# Altium project T35_V2.PrjPCB
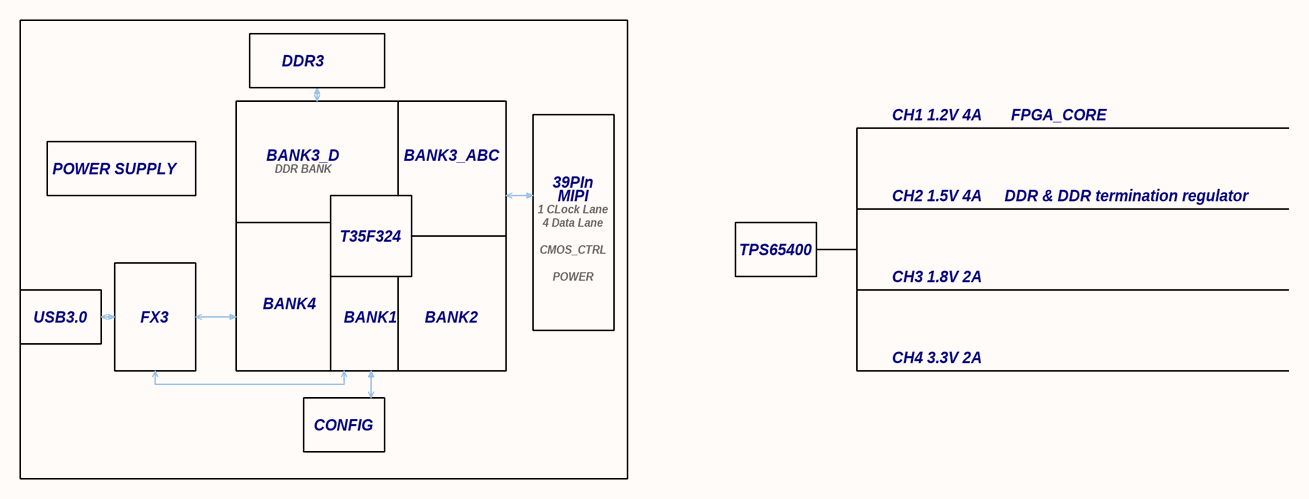
[diagram p0: T35_0_BlockSch&POWERTREE.SchDoc]
9 sheets, 356 parts. Net scope: global (net labels, ports and power ports of the same name join across sheets).
Board file: T35_V2.1.PcbDoc
Sheets:
  T35_0_BlockSch&POWERTREE.SchDoc
  T35_1_IO.SchDoc
  T35_2_POWER_CONFIG.SchDoc
  T35_3_POWERSUPPLY.SchDoc
  T35_4_FX3.SchDoc
  T35_5_MIPI.SchDoc
  T35_6_DDR3.SchDoc
  T35_7_MEMORY.SchDoc
  T35_8_CONNECTORS.SchDoc

## Sheet T35_0_BlockSch&POWERTREE.SchDoc
size A4

### Notes on the sheet
- DDR3
- CH1 1.2V 4A
- FPGA_CORE
- POWER SUPPLY
- BANK3_D
- DDR BANK
- BANK3_ABC
- MIPI
- 39PIn
- CH2 1.5V 4A
- DDR & DDR termination regulator
- T35F324
- 1 CLock Lane
- 4 Data Lane
- CMOS_CTRL
- TPS65400
- USB3.0
- FX3
- BANK4
- BANK1
- BANK2
- POWER
- CH3 1.8V 2A
- CH4 3.3V 2A
- CONFIG

## Sheet T35_1_IO.SchDoc
size A4
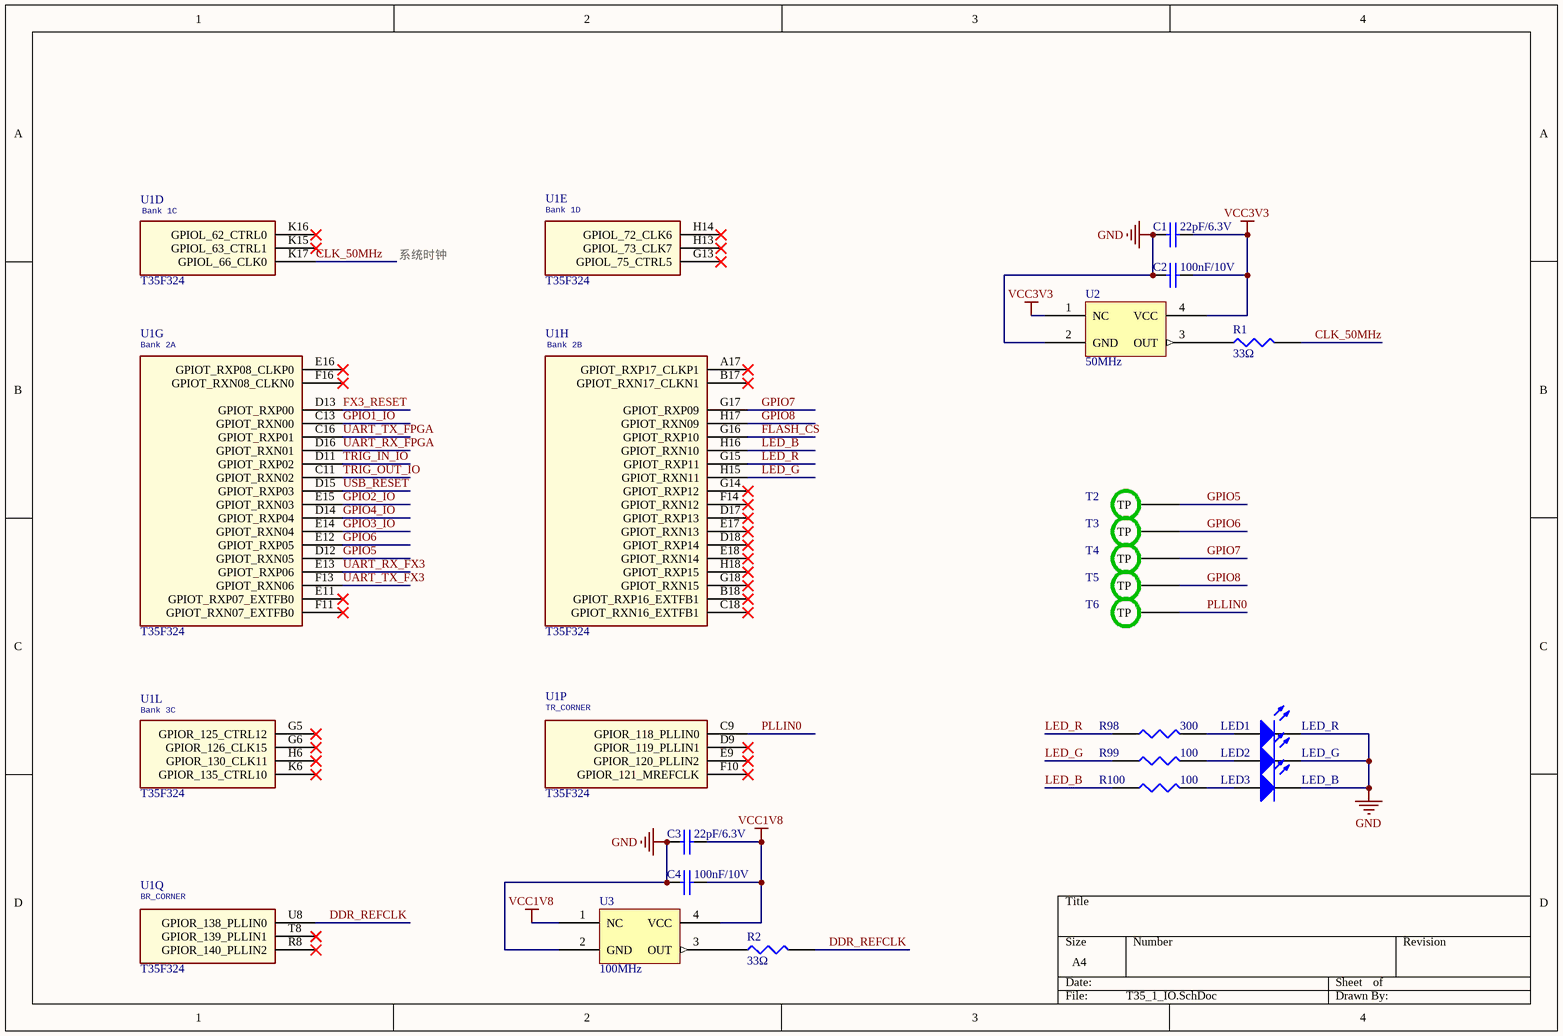
[diagram p1: T35_1_IO.SchDoc]

### Parts
C1  22pF/6.3V  [0201CS]
C2  100nF/10V  [0201CS]
C3  22pF/6.3V  [0201CS]
C4  100nF/10V  [0201CS]
LED1  LED_R  [0402LED]
LED2  LED_G  [0402LED]
LED3  LED_B  [0402LED]
R1  33Ω  [0402RS]
R2  33Ω  [0402RS]
R98  300  [0201RS]
R99  100  [0201RS]
R100  100  [0201RS]
T2  (no value)  [TP-S]
T3  (no value)  [TP-S]
T4  (no value)  [TP-S]
T5  (no value)  [TP-S]
T6  (no value)  [TP-S]
U1  T35F324  [T35-F324-BGA100P9X9-81A]  (parts D,E,G,H,L,P,Q of 17)
U2  50MHz  [XTAL_SMD_SMALL]
U3  100MHz  [XTAL_SMD_SMALL]

### Nets
GND: C1.1 C2.2 C3.1 C4.2 LED1.2(K) LED2.2(K) LED3.2(K) U2.2(GND) U3.2(GND)
VCC1V8: C3.2 C4.1 U3.1(NC) U3.4(VCC)
VCC3V3: C1.2 C2.1 U2.1(NC) U2.4(VCC)
CLK_50MHz: R1.2 U1.K17(GPIOL_66_CLK0)
DDR_REFCLK: R2.2 U1.U8(GPIOR_138_PLLIN0)
FLASH_CS: U1.G16(GPIOT_RXP10)
FX3_RESET: U1.D13(GPIOT_RXP00)
GPIO1_IO: U1.C13(GPIOT_RXN00)
GPIO2_IO: U1.E15(GPIOT_RXN03)
GPIO3_IO: U1.E14(GPIOT_RXN04)
GPIO4_IO: U1.D14(GPIOT_RXP04)
GPIO5: T2.1(TP) U1.D12(GPIOT_RXN05)
GPIO6: T3.1(TP) U1.E12(GPIOT_RXP05)
GPIO7: T4.1(TP) U1.G17(GPIOT_RXP09)
GPIO8: T5.1(TP) U1.H17(GPIOT_RXN09)
LED_B: R100.1 U1.H16(GPIOT_RXN10)
LED_G: R99.1 U1.H15(GPIOT_RXN11)
LED_R: R98.1 U1.G15(GPIOT_RXP11)
PLLIN0: T6.1(TP) U1.C9(GPIOR_118_PLLIN0)
TRIG_IN_IO: U1.D11(GPIOT_RXP02)
TRIG_OUT_IO: U1.C11(GPIOT_RXN02)
UART_RX_FPGA: U1.D16(GPIOT_RXN01)
UART_RX_FX3: U1.E13(GPIOT_RXP06)
UART_TX_FPGA: U1.C16(GPIOT_RXP01)
UART_TX_FX3: U1.F13(GPIOT_RXN06)
USB_RESET: U1.D15(GPIOT_RXP03)
NetLED1_1: LED1.1(A) R98.2
NetLED2_1: LED2.1(A) R99.2
NetLED3_1: LED3.1(A) R100.2
NetR1_1: R1.1 U2.3(OUT)
NetR2_1: R2.1 U3.3(OUT)

Not connected (* = marked no-connect by the designer): U1 A17(GPIOT_RXP17_CLKP1)* B17(GPIOT_RXN17_CLKN1)* B18(GPIOT_RXP16_EXTFB1)* C18(GPIOT_RXN16_EXTFB1)* D9(GPIOR_119_PLLIN1)* D17(GPIOT_RXP13)* D18(GPIOT_RXP14)* E9(GPIOR_120_PLLIN2)* E11(GPIOT_RXP07_EXTFB0)* E16(GPIOT_RXP08_CLKP0)* E17(GPIOT_RXN13)* E18(GPIOT_RXN14)* F10(GPIOR_121_MREFCLK)* F11(GPIOT_RXN07_EXTFB0)* F14(GPIOT_RXN12)* F16(GPIOT_RXN08_CLKN0)* G5(GPIOR_125_CTRL12)* G6(GPIOR_126_CLK15)* G13(GPIOL_75_CTRL5)* G14(GPIOT_RXP12)* G18(GPIOT_RXN15)* H6(GPIOR_130_CLK11)* H13(GPIOL_73_CLK7)* H14(GPIOL_72_CLK6)* H18(GPIOT_RXP15)* K6(GPIOR_135_CTRL10)* K15(GPIOL_63_CTRL1)* K16(GPIOL_62_CTRL0)* R8(GPIOR_140_PLLIN2)* T8(GPIOR_139_PLLIN1)*

### Notes on the sheet
- 系统时钟
- (in symbol T35F324, part D) Bank 1C
- (in symbol T35F324, part E) Bank 1D
- (in symbol T35F324, part G) Bank 2A
- (in symbol T35F324, part H) Bank 2B
- (in symbol T35F324, part L) Bank 3C
- (in symbol T35F324, part P) TR_CORNER
- (in symbol T35F324, part Q) BR_CORNER

### Library data of the parts
C1 C3 = CAP: 贴片电容; Value: 22pF ±5% 50V
C2 C4 = CAP: 贴片电容; Value: 0.1uF ±10% 16V; ComponentLink1Description: Link; ComponentLink1URL: https://item.szlcsc.com/456838.html
LED1 = LED1: 红色LED; Published: 8-Jun-2000; LatestRevisionDate: 08-Jul-2005; LatestRevisionNote: Mech Layer 1 removed.; PackageReference: LED-1; Publisher: Altium Limited; Link: https://item.szlcsc.com/142008.html
LED2 = LED1: 绿色LED; Published: 8-Jun-2000; LatestRevisionDate: 08-Jul-2005; LatestRevisionNote: Mech Layer 1 removed.; PackageReference: LED-1; Publisher: Altium Limited; Link: https://item.szlcsc.com/142012.html
LED3 = LED1: 蓝色LED; Published: 8-Jun-2000; LatestRevisionDate: 08-Jul-2005; LatestRevisionNote: Mech Layer 1 removed.; PackageReference: LED-1; Publisher: Altium Limited; Link: https://item.szlcsc.com/142013.html
R1 R2 = RES1: 贴片电阻; Value: 33Ω ±1%
R98-R100 = RES1: 贴片电阻; Value: 10K,±1%
T2-T6 = TP: 测试点; Value: 测试点
U1 = T35F324: FPGA芯片; SWAP_INFO: (S1+S2+S3+S4+S5+S6+S7+S8+S9+S10+S11+S12+S13+S14+S15+S16+S17); SPLIT_INST: TRUE
U2 U3 = 24LC00: 贴片有源晶振; Value: SIT8008BI-21-18N-72.000000

## Sheet T35_2_POWER_CONFIG.SchDoc
size A3
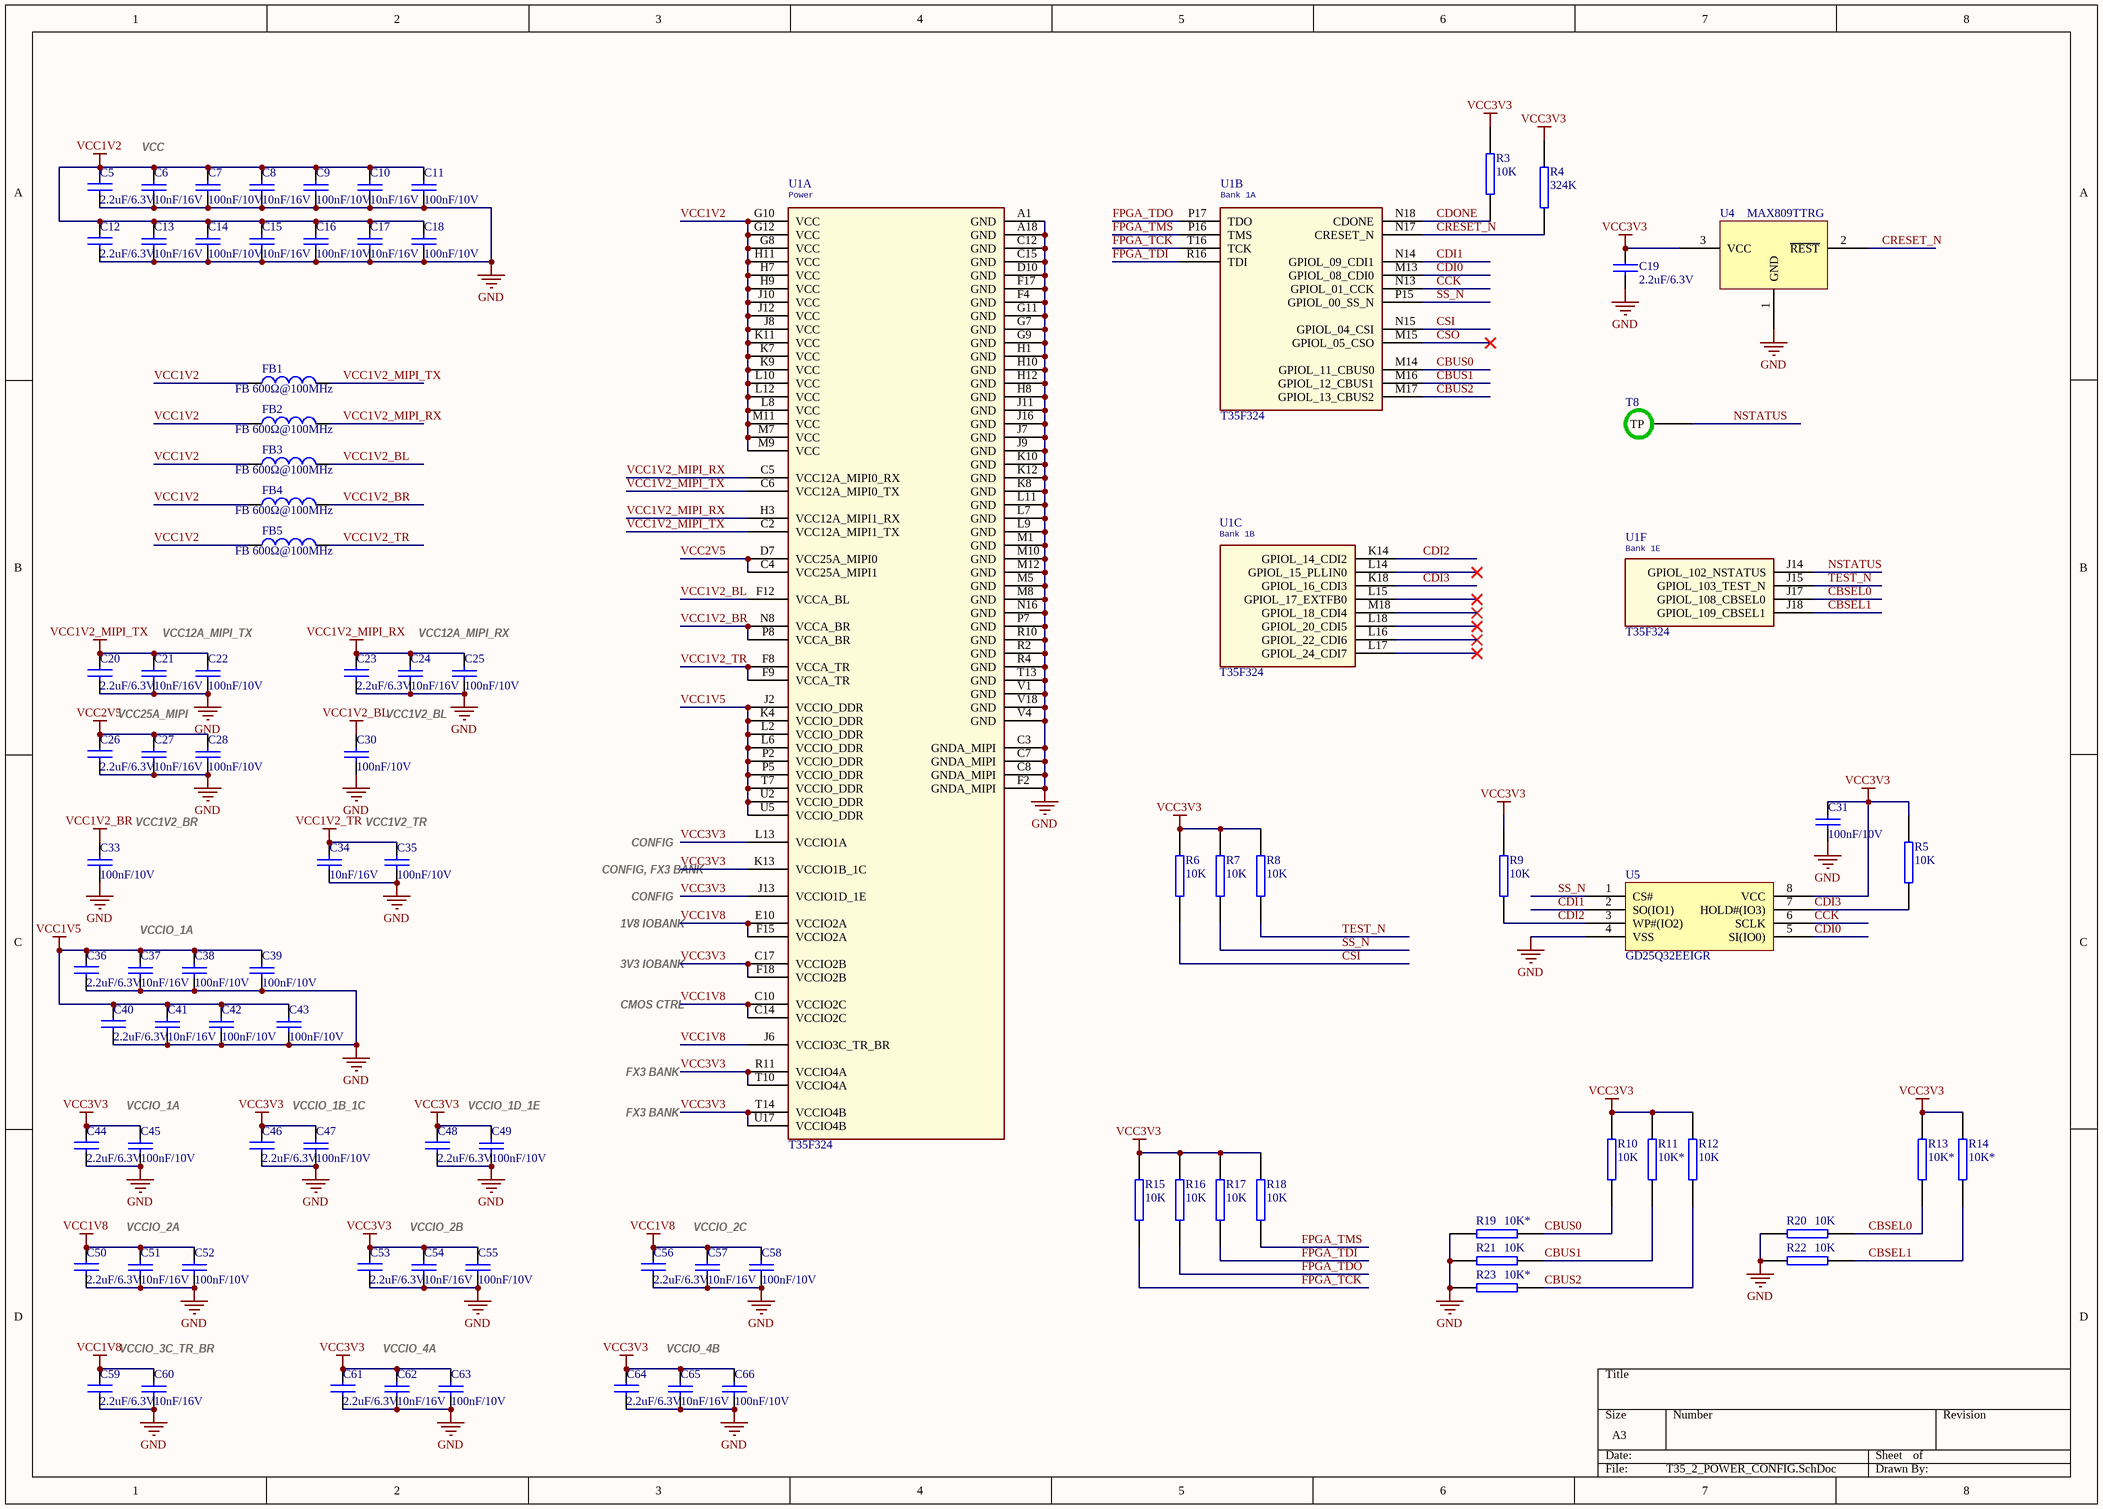
[diagram p2: T35_2_POWER_CONFIG.SchDoc]

### Parts
C5  2.2uF/6.3V  [0201CS]
C6  10nF/16V  [0201CS]
C7  100nF/10V  [0201CS]
C8  10nF/16V  [0201CS]
C9  100nF/10V  [0201CS]
C10  10nF/16V  [0201CS]
C11  100nF/10V  [0201CS]
C12  2.2uF/6.3V  [0201CS]
C13  10nF/16V  [0201CS]
C14  100nF/10V  [0201CS]
C15  10nF/16V  [0201CS]
C16  100nF/10V  [0201CS]
C17  10nF/16V  [0201CS]
C18  100nF/10V  [0201CS]
C19  2.2uF/6.3V  [0201CS]
C20  2.2uF/6.3V  [0201CS]
C21  10nF/16V  [0201CS]
C22  100nF/10V  [0201CS]
C23  2.2uF/6.3V  [0201CS]
C24  10nF/16V  [0201CS]
C25  100nF/10V  [0201CS]
C26  2.2uF/6.3V  [0201CS]
C27  10nF/16V  [0201CS]
C28  100nF/10V  [0201CS]
C30  100nF/10V  [0201CS]
C31  100nF/10V  [0201CS]
C33  100nF/10V  [0201CS]
C34  10nF/16V  [0201CS]
C35  100nF/10V  [0201CS]
C36  2.2uF/6.3V  [0201CS]
C37  10nF/16V  [0201CS]
C38  100nF/10V  [0201CS]
C39  100nF/10V  [0201CS]
C40  2.2uF/6.3V  [0201CS]
C41  10nF/16V  [0201CS]
C42  100nF/10V  [0201CS]
C43  100nF/10V  [0201CS]
C44  2.2uF/6.3V  [0201CS]
C45  100nF/10V  [0201CS]
C46  2.2uF/6.3V  [0201CS]
C47  100nF/10V  [0201CS]
C48  2.2uF/6.3V  [0201CS]
C49  100nF/10V  [0201CS]
C50  2.2uF/6.3V  [0201CS]
C51  10nF/16V  [0201CS]
C52  100nF/10V  [0201CS]
C53  2.2uF/6.3V  [0201CS]
C54  10nF/16V  [0201CS]
C55  100nF/10V  [0201CS]
C56  2.2uF/6.3V  [0201CS]
C57  10nF/16V  [0201CS]
C58  100nF/10V  [0201CS]
C59  2.2uF/6.3V  [0201CS]
C60  10nF/16V  [0201CS]
C61  2.2uF/6.3V  [0201CS]
C62  10nF/16V  [0201CS]
C63  100nF/10V  [0201CS]
C64  2.2uF/6.3V  [0201CS]
C65  10nF/16V  [0201CS]
C66  100nF/10V  [0201CS]
FB1  FB 600Ω@100MHz  [FB0603]
FB2  FB 600Ω@100MHz  [FB0603]
FB3  FB 600Ω@100MHz  [FB0603]
FB4  FB 600Ω@100MHz  [FB0603]
FB5  FB 600Ω@100MHz  [FB0603]
R3  10K  [0201RS]
R4  324K  [0402RS]
R5  10K  [0201RS]
R6  10K  [0201RS]
R7  10K  [0201RS]
R8  10K  [0201RS]
R9  10K  [0201RS]
R10  10K  [0201RS]
R11  10K*  [0201RS]
R12  10K  [0201RS]
R13  10K*  [0201RS]
R14  10K*  [0201RS]
R15  10K  [0201RS]
R16  10K  [0201RS]
R17  10K  [0201RS]
R18  10K  [0201RS]
R19  10K*  [0201RS]
R20  10K  [0201RS]
R21  10K  [0201RS]
R22  10K  [0201RS]
R23  10K*  [0201RS]
T8  (no value)  [TP-S]
U1  T35F324  [T35-F324-BGA100P9X9-81A]  (parts A,B,C,F of 17)
U4  MAX809TTRG  [MAX809]
U5  GD25Q32EEIGR  [SON127P600-8N-USON8]

### Nets
GND: C5.2 C6.2 C7.2 C8.2 C9.2 C10.2 C11.2 C12.2 C13.2 C14.2 C15.2 C16.2 C17.2 C18.2 C19.2 C20.2 C21.2 C22.2 C23.2 C24.2 C25.2 C26.2 C27.2 C28.2 C30.2 C31.2 C33.2 C34.2 C35.2 C36.2 C37.2 C38.2 C39.2 C40.2 C41.2 C42.2 C43.2 C44.2 C45.2 C46.2 C47.2 C48.2 C49.2 C50.2 C51.2 C52.2 C53.2 C54.2 C55.2 C56.2 C57.2 C58.2 C59.2 C60.2 C61.2 C62.2 C63.2 C64.2 C65.2 C66.2 R19.1 R20.1 R21.1 R22.1 R23.1 U1.A1(GND) U1.A18(GND) U1.C3(GNDA_MIPI) U1.C7(GNDA_MIPI) U1.C8(GNDA_MIPI) U1.C12(GND) U1.C15(GND) U1.D10(GND) U1.F2(GNDA_MIPI) U1.F4(GND) U1.F17(GND) U1.G7(GND) U1.G9(GND) U1.G11(GND) U1.H1(GND) U1.H8(GND) U1.H10(GND) U1.H12(GND) U1.J7(GND) U1.J9(GND) U1.J11(GND) U1.J16(GND) U1.K8(GND) U1.K10(GND) U1.K12(GND) U1.L7(GND) U1.L9(GND) U1.L11(GND) U1.M1(GND) U1.M5(GND) U1.M8(GND) U1.M10(GND) U1.M12(GND) U1.N16(GND) U1.P7(GND) U1.R2(GND) U1.R4(GND) U1.R10(GND) U1.T13(GND) U1.V1(GND) U1.V4(GND) U1.V18(GND) U4.1(GND) U5.4(VSS)
VCC1V2: C5.1 C6.1 C7.1 C8.1 C9.1 C10.1 C11.1 C12.1 C13.1 C14.1 C15.1 C16.1 C17.1 C18.1 FB1.1 FB2.1 FB3.1 FB4.1 FB5.1 U1.G8(VCC) U1.G10(VCC) U1.G12(VCC) U1.H7(VCC) U1.H9(VCC) U1.H11(VCC) U1.J8(VCC) U1.J10(VCC) U1.J12(VCC) U1.K7(VCC) U1.K9(VCC) U1.K11(VCC) U1.L8(VCC) U1.L10(VCC) U1.L12(VCC) U1.M7(VCC) U1.M9(VCC) U1.M11(VCC)
VCC1V2_BL: C30.1 FB3.2 U1.F12(VCCA_BL)
VCC1V2_BR: C33.1 FB4.2 U1.N8(VCCA_BR) U1.P8(VCCA_BR)
VCC1V2_MIPI_RX: C23.1 C24.1 C25.1 FB2.2 U1.C5(VCC12A_MIPI0_RX) U1.H3(VCC12A_MIPI1_RX)
VCC1V2_MIPI_TX: C20.1 C21.1 C22.1 FB1.2 U1.C2(VCC12A_MIPI1_TX) U1.C6(VCC12A_MIPI0_TX)
VCC1V2_TR: C34.1 C35.1 FB5.2 U1.F8(VCCA_TR) U1.F9(VCCA_TR)
VCC1V5: C36.1 C37.1 C38.1 C39.1 C40.1 C41.1 C42.1 C43.1 U1.J2(VCCIO_DDR) U1.K4(VCCIO_DDR) U1.L2(VCCIO_DDR) U1.L6(VCCIO_DDR) U1.P2(VCCIO_DDR) U1.P5(VCCIO_DDR) U1.T7(VCCIO_DDR) U1.U2(VCCIO_DDR) U1.U5(VCCIO_DDR)
VCC1V8: C50.1 C51.1 C52.1 C56.1 C57.1 C58.1 C59.1 C60.1 U1.C10(VCCIO2C) U1.C14(VCCIO2C) U1.E10(VCCIO2A) U1.F15(VCCIO2A) U1.J6(VCCIO3C_TR_BR)
VCC2V5: C26.1 C27.1 C28.1 U1.C4(VCC25A_MIPI1) U1.D7(VCC25A_MIPI0)
VCC3V3: C19.1 C31.1 C44.1 C45.1 C46.1 C47.1 C48.1 C49.1 C53.1 C54.1 C55.1 C61.1 C62.1 C63.1 C64.1 C65.1 C66.1 R3.1 R4.1 R5.2 R6.1 R7.1 R8.1 R9.2 R10.1 R11.1 R12.1 R13.1 R14.1 R15.1 R16.1 R17.1 R18.1 U1.C17(VCCIO2B) U1.F18(VCCIO2B) U1.J13(VCCIO1D_1E) U1.K13(VCCIO1B_1C) U1.L13(VCCIO1A) U1.R11(VCCIO4A) U1.T10(VCCIO4A) U1.T14(VCCIO4B) U1.U17(VCCIO4B) U4.3(VCC) U5.8(VCC)
CBSEL0: R13.2 R20.2 U1.J17(GPIOL_108_CBSEL0)
CBSEL1: R14.2 R22.2 U1.J18(GPIOL_109_CBSEL1)
CBUS0: R10.2 R19.2 U1.M14(GPIOL_11_CBUS0)
CBUS1: R11.2 R21.2 U1.M16(GPIOL_12_CBUS1)
CBUS2: R12.2 R23.2 U1.M17(GPIOL_13_CBUS2)
CCK: U1.N13(GPIOL_01_CCK) U5.6(SCLK)
CDI0: U1.M13(GPIOL_08_CDI0) U5.5(SI(IO0))
CDI1: U1.N14(GPIOL_09_CDI1) U5.2(SO(IO1))
CDI2: R9.1 U1.K14(GPIOL_14_CDI2) U5.3(WP#(IO2))
CDI3: R5.1 U1.K18(GPIOL_16_CDI3) U5.7(HOLD#(IO3))
CDONE: R3.2 U1.N18(CDONE)
CRESET_N: R4.2 U1.N17(CRESET_N) U4.2(~{REST})
CSI: R6.2 U1.N15(GPIOL_04_CSI)
CSO: U1.M15(GPIOL_05_CSO)
FPGA_TCK: R15.2 U1.T16(TCK)
FPGA_TDI: R17.2 U1.R16(TDI)
FPGA_TDO: R16.2 U1.P17(TDO)
FPGA_TMS: R18.2 U1.P16(TMS)
NSTATUS: T8.1(TP) U1.J14(GPIOL_102_NSTATUS)
SS_N: R7.2 U1.P15(GPIOL_00_SS_N) U5.1(CS#)
TEST_N: R8.2 U1.J15(GPIOL_103_TEST_N)

Not connected (* = marked no-connect by the designer): U1 L14(GPIOL_15_PLLIN0)* L15(GPIOL_17_EXTFB0)* L16(GPIOL_22_CDI6)* L17(GPIOL_24_CDI7)* L18(GPIOL_20_CDI5)* M18(GPIOL_18_CDI4)*

### Notes on the sheet
- (near C6) VCC
- VCC12A_MIPI_TX
- VCC12A_MIPI_RX
- VCC25A_MIPI
- VCC1V2_BL
- VCC1V2_BR
- (near C35) VCC1V2_TR
- CONFIG
- CONFIG, FX3 BANK
- 1V8 IOBANK
- VCCIO_1A
- 3V3 IOBANK
- CMOS CTRL
- (near C45) VCCIO_1A
- VCCIO_1B_1C
- VCCIO_1D_1E
- FX3 BANK
- VCCIO_2A
- VCCIO_2B
- VCCIO_2C
- VCCIO_3C_TR_BR
- VCCIO_4A
- VCCIO_4B
- (in symbol T35F324, part A) Power
- (in symbol T35F324, part B) Bank 1A
- (in symbol T35F324, part C) Bank 1B
- (in symbol T35F324, part F) Bank 1E

### Library data of the parts
C5 C12 C19 C20 C23 C26 C36 C40 C44 C46 C48 C50 C53 C56 C59 C61 C64 = CAPACITOR NON-POL: 贴片电容; Link: https://item.szlcsc.com/359940.html
C6-C11 C13-C18 C21 C22 C24 C25 C27 C28 C30 C33-C35 C37-C39 C41-C43 C45 C47 C49 C51 C52 C54 C55 C57 C58 C60 C62 C63 C65 C66 = CAP: 贴片电容
  C6 C8 C10 C13 C15 C17 C21 C24 C27 C34 C37 C41 C51 C54 C57 C60 C62 C65: Link: https://item.szlcsc.com/78065.html
  C7 C9 C11 C14 C16 C18 C22 C25 C28 C30 C33 C35 C38 C39 C42 C43 C45 C47 C49 C52 C55 C58 C63 C66: Link: https://item.szlcsc.com/456838.html
C31 = CAP: 贴片电容; Value: 0.1uF ±10% 16V; Link: https://item.szlcsc.com/456838.html
FB1-FB5 = Inductor: 贴片磁珠; Link: https://item.szlcsc.com/948048.html
R3-R23 = RES2: 贴片电阻
T8 = TP: 测试点
U1 = T35F324: as U1 on sheet T35_1_IO
U4 = MAX809: 复位芯片
U5 = GD25Q64ESIG: SPI Flash

## Sheet T35_3_POWERSUPPLY.SchDoc
size A3
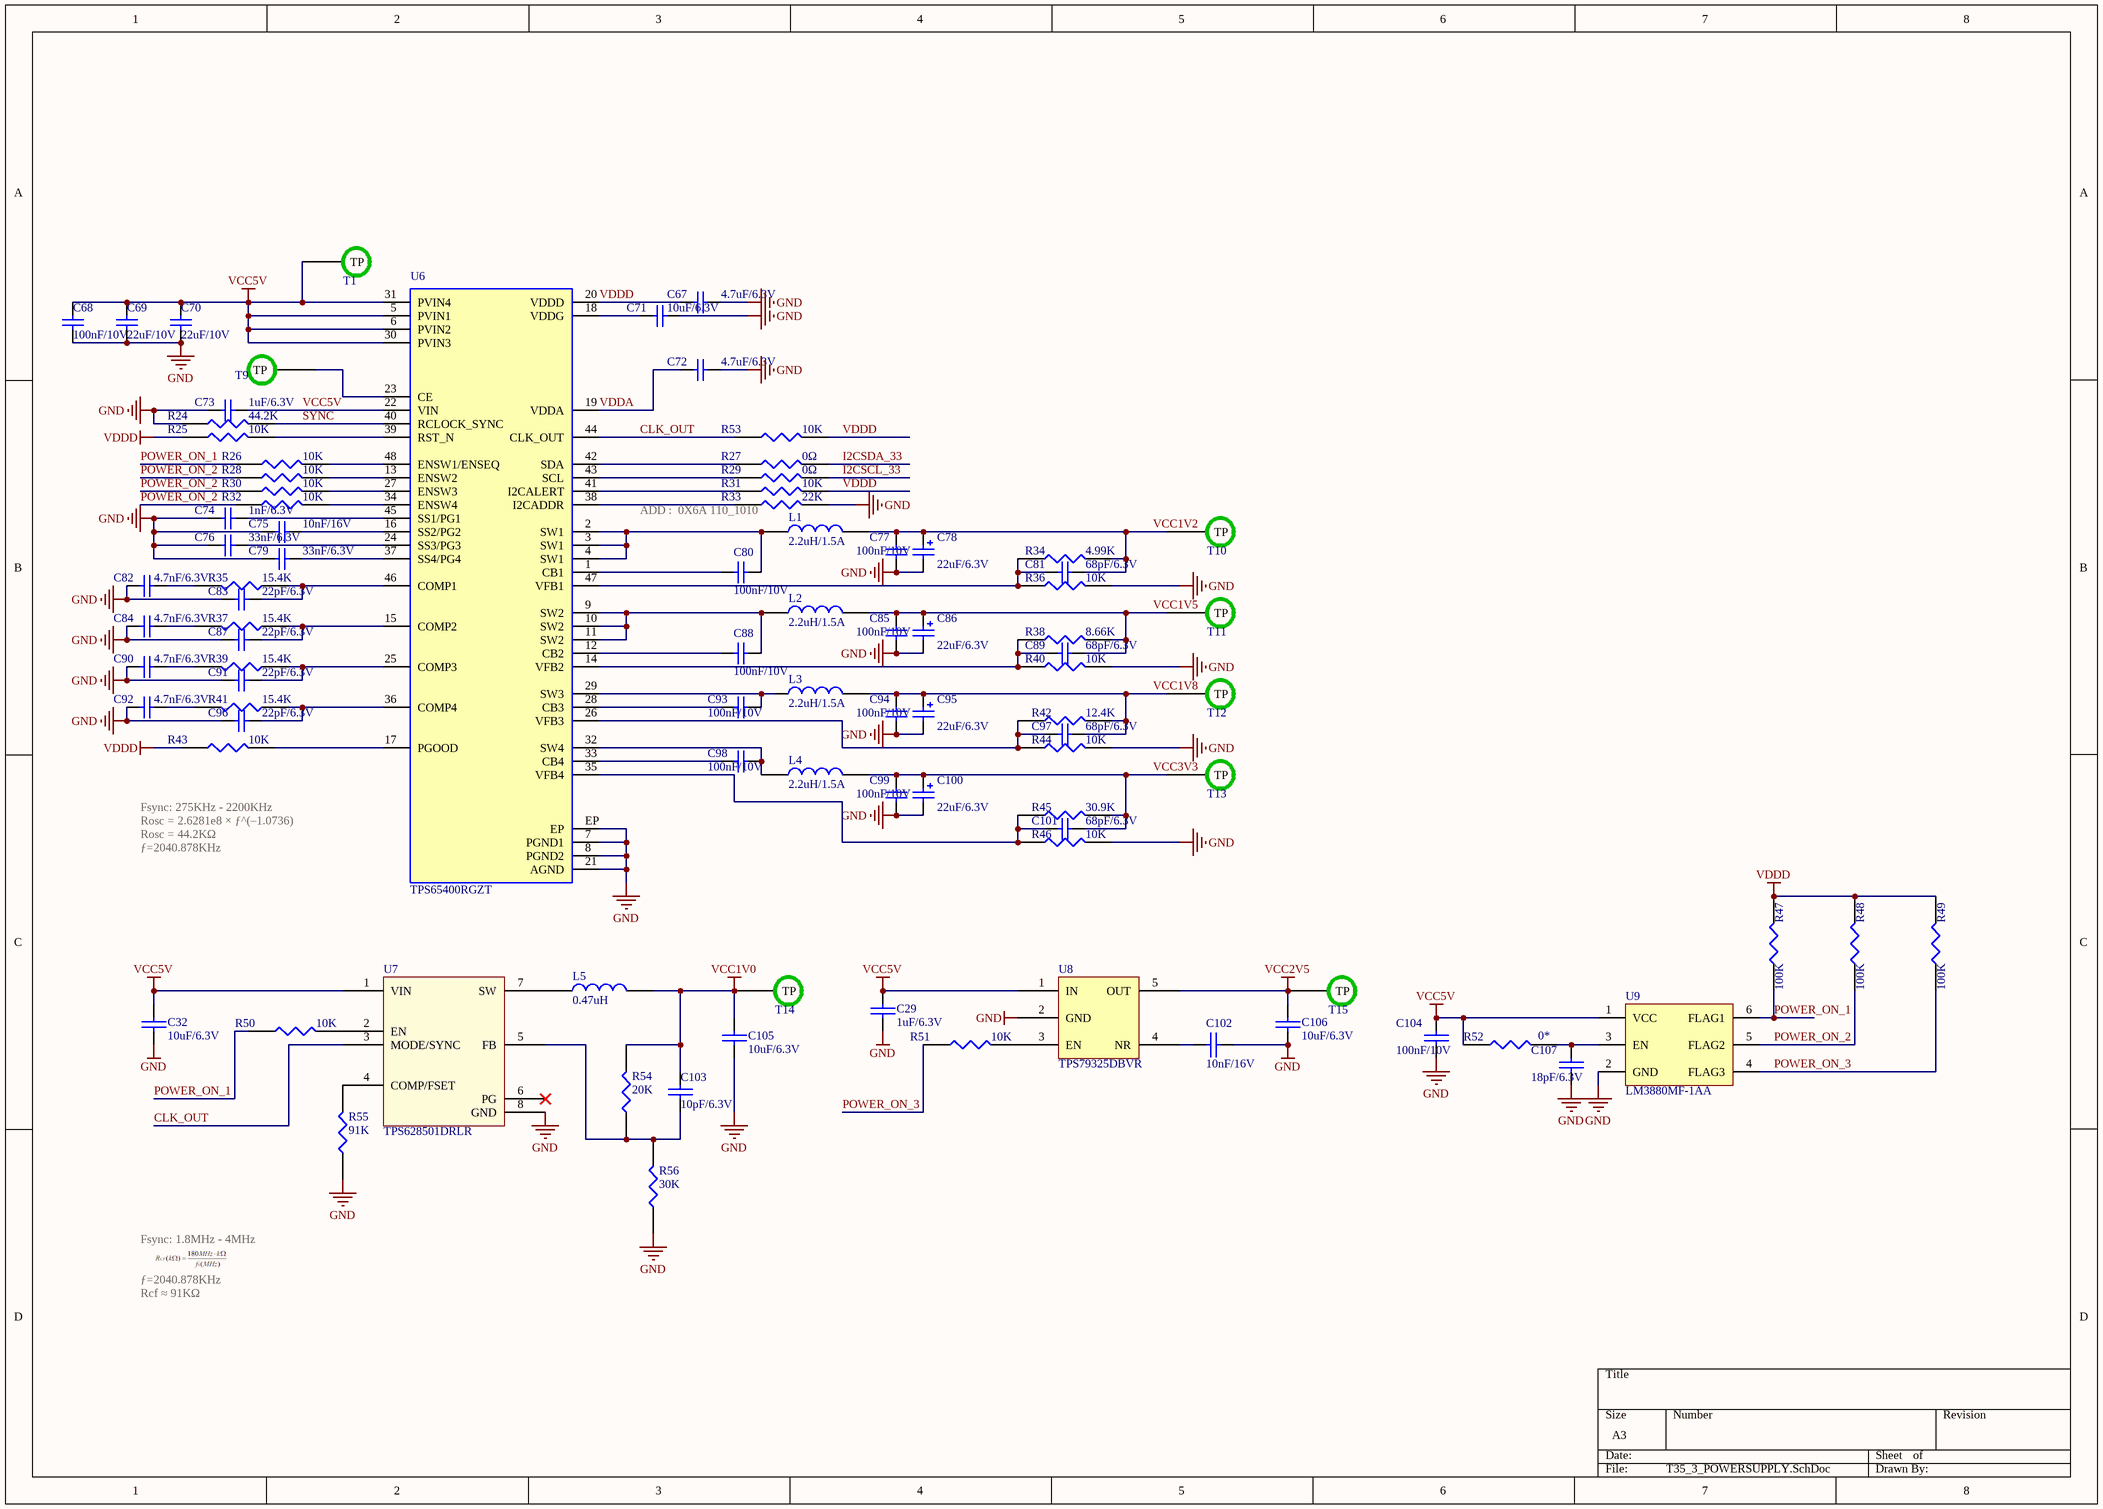
[diagram p3: T35_3_POWERSUPPLY.SchDoc]

### Parts
C29  1uF/6.3V  [0201CS]
C32  10uF/6.3V  [0402CS]
C67  4.7uF/6.3V  [0402CS]
C68  100nF/10V  [0201CS]
C69  22uF/10V  [0603CS]
C70  22uF/10V  [0603CS]
C71  10uF/6.3V  [0402CS]
C72  4.7uF/6.3V  [0402CS]
C73  1uF/6.3V  [0201CS]
C74  1nF/6.3V  [0201CS]
C75  10nF/16V  [0201CS]
C76  33nF/6.3V  [0201CS]
C77  100nF/10V  [0201CS]
C78  22uF/6.3V  [0603CS]
C79  33nF/6.3V  [0201CS]
C80  100nF/10V  [0201CS]
C81  68pF/6.3V  [0201CS]
C82  4.7nF/6.3V  [0201CS]
C83  22pF/6.3V  [0201CS]
C84  4.7nF/6.3V  [0201CS]
C85  100nF/10V  [0201CS]
C86  22uF/6.3V  [0603CS]
C87  22pF/6.3V  [0201CS]
C88  100nF/10V  [0201CS]
C89  68pF/6.3V  [0201CS]
C90  4.7nF/6.3V  [0201CS]
C91  22pF/6.3V  [0201CS]
C92  4.7nF/6.3V  [0201CS]
C93  100nF/10V  [0201CS]
C94  100nF/10V  [0201CS]
C95  22uF/6.3V  [0603CS]
C96  22pF/6.3V  [0201CS]
C97  68pF/6.3V  [0201CS]
C98  100nF/10V  [0201CS]
C99  100nF/10V  [0201CS]
C100  22uF/6.3V  [0603CS]
C101  68pF/6.3V  [0201CS]
C102  10nF/16V  [0201CS]
C103  10pF/6.3V  [0201CS]
C104  100nF/10V  [0201CS]
C105  10uF/6.3V  [0402CS]
C106  10uF/6.3V  [0402CS]
C107  18pF/6.3V  [0201CS]
L1  2.2uH/1.5A  [201610]
L2  2.2uH/1.5A  [201610]
L3  2.2uH/1.5A  [201610]
L4  2.2uH/1.5A  [201610]
L5  0.47uH  [201610]
R24  44.2K  [0201RS]
R25  10K  [0201RS]
R26  10K  [0201RS]
R27  0Ω  [0201RS]
R28  10K  [0201RS]
R29  0Ω  [0201RS]
R30  10K  [0201RS]
R31  10K  [0201RS]
R32  10K  [0201RS]
R33  22K  [0201RS]
R34  4.99K  [0201RS]
R35  15.4K  [0201RS]
R36  10K  [0201RS]
R37  15.4K  [0201RS]
R38  8.66K  [0201RS]
R39  15.4K  [0201RS]
R40  10K  [0201RS]
R41  15.4K  [0201RS]
R42  12.4K  [0201RS]
R43  10K  [0201RS]
R44  10K  [0201RS]
R45  30.9K  [0201RS]
R46  10K  [0201RS]
R47  100K  [0201RS]
R48  100K  [0201RS]
R49  100K  [0201RS]
R50  10K  [0201RS]
R51  10K  [0201RS]
R52  0*  [0201RS]
R53  10K  [0201RS]
R54  20K  [0201RS]
R55  91K  [0201RS]
R56  30K  [0201RS]
T1  (no value)  [TP-S]
T9  (no value)  [TP-S]
T10  (no value)  [TP-S]
T11  (no value)  [TP-S]
T12  (no value)  [TP-S]
T13  (no value)  [TP-S]
T14  (no value)  [TP-S]
T15  (no value)  [TP-S]
U6  TPS65400RGZT  [QFN50P700X700X100-49N_TPS65400RGZT(Primary)]
U7  TPS628501DRLR  [SOT583]
U8  TPS79325DBVR  [SOT-23-5]
U9  LM3880MF-1AA  [SOT-23-6]

### Nets
GND: C29.2 C32.2 C67.2 C68.1 C69.1 C70.1 C71.2 C72.2 C73.1 C74.1 C75.1 C76.1 C77.1 C78.2 C79.1 C82.2 C83.2 C84.2 C85.1 C86.2 C87.2 C90.2 C91.2 C92.2 C94.1 C95.2 C96.2 C99.1 C100.2 C102.2 C104.2 C105.2 C106.2 C107.2 R24.1 R33.2 R36.2 R40.2 R44.2 R46.2 R55.1 R56.1 U6.7(PGND1) U6.8(PGND2) U6.21(AGND) U6.EP U7.8(GND) U8.2(GND) U9.2(GND)
VCC1V0: C103.1 C105.1 L5.2 R54.2 T14.1(TP)
VCC1V2: C77.2 C78.1 C81.1 L1.2 R34.2 T10.1(TP)
VCC1V5: C85.2 C86.1 C89.1 L2.2 R38.2 T11.1(TP)
VCC1V8: C94.2 C95.1 C97.1 L3.2 R42.2 T12.1(TP)
VCC2V5: C106.1 T15.1(TP) U8.5(OUT)
VCC3V3: C99.2 C100.1 C101.1 L4.2 R45.2 T13.1(TP)
VCC5V: C29.1 C32.1 C68.2 C69.2 C70.2 C73.2 C104.1 R52.1 T1.1(TP) U6.5(PVIN1) U6.6(PVIN2) U6.22(VIN) U6.30(PVIN3) U6.31(PVIN4) U7.1(VIN) U8.1(IN) U9.1(VCC)
VDDD: C67.1 R25.1 R31.2 R43.1 R47.2 R48.2 R49.2 R53.2 U6.20(VDDD)
CLK_OUT: R53.1 U6.44(CLK_OUT) U7.3(MODE/SYNC)
I2CSCL_33: R29.2
I2CSDA_33: R27.2
POWER_ON_1: R26.1 R47.1 R50.1 U9.6(FLAG1)
POWER_ON_2: R28.1 R30.1 R32.1 R48.1 U9.5(FLAG2)
POWER_ON_3: R49.1 R51.1 U9.4(FLAG3)
SYNC: R24.2 U6.40(RCLOCK_SYNC)
VDDA: C72.1 U6.19(VDDA)
NetC71_1: C71.1 U6.18(VDDG)
NetC74_2: C74.2 U6.45(SS1/PG1)
NetC75_2: C75.2 U6.16(SS2/PG2)
NetC76_2: C76.2 U6.24(SS3/PG3)
NetC79_2: C79.2 U6.37(SS4/PG4)
NetC80_1: C80.1 L1.1 U6.2(SW1) U6.3(SW1) U6.4(SW1)
NetC80_2: C80.2 U6.1(CB1)
NetC81_2: C81.2 R34.1 R36.1 U6.47(VFB1)
NetC82_1: C82.1 R35.2
NetC83_1: C83.1 R35.1 U6.46(COMP1)
NetC84_1: C84.1 R37.2
NetC87_1: C87.1 R37.1 U6.15(COMP2)
NetC88_1: C88.1 L2.1 U6.9(SW2) U6.10(SW2) U6.11(SW2)
NetC88_2: C88.2 U6.12(CB2)
NetC89_2: C89.2 R38.1 R40.1 U6.14(VFB2)
NetC90_1: C90.1 R39.2
NetC91_1: C91.1 R39.1 U6.25(COMP3)
NetC92_1: C92.1 R41.2
NetC93_1: C93.1 L3.1 U6.29(SW3)
NetC93_2: C93.2 U6.28(CB3)
NetC96_1: C96.1 R41.1 U6.36(COMP4)
NetC97_2: C97.2 R42.1 R44.1 U6.26(VFB3)
NetC98_1: C98.1 L4.1 U6.32(SW4)
NetC98_2: C98.2 U6.33(CB4)
NetC101_2: C101.2 R45.1 R46.1 U6.35(VFB4)
NetC102_1: C102.1 U8.4(NR)
NetC103_2: C103.2 R54.1 R56.2 U7.5(FB)
NetC107_1: C107.1 R52.2 U9.3(EN)
NetL5_1: L5.1 U7.7(SW)
NetR25_2: R25.2 U6.39(RST_N)
NetR26_2: R26.2 U6.48(ENSW1/ENSEQ)
NetR27_1: R27.1 U6.42(SDA)
NetR28_2: R28.2 U6.13(ENSW2)
NetR29_1: R29.1 U6.43(SCL)
NetR30_2: R30.2 U6.27(ENSW3)
NetR31_1: R31.1 U6.41(I2CALERT)
NetR32_2: R32.2 U6.34(ENSW4)
NetR33_1: R33.1 U6.38(I2CADDR)
NetR43_2: R43.2 U6.17(PGOOD)
NetR50_2: R50.2 U7.2(EN)
NetR51_2: R51.2 U8.3(EN)
NetR55_2: R55.2 U7.4(COMP/FSET)
NetT9_1: T9.1(TP) U6.23(CE)

Not connected (* = marked no-connect by the designer): U7 6(PG)*

### Notes on the sheet
- (near R33) ADD :  0X6A 110_1010
- Fsync: 275KHz - 2200KHz
- Rosc = 2.6281e8 × ƒ^(–1.0736)
- Rosc = 44.2KΩ
- ƒ=2040.878KHz
- Fsync: 1.8MHz - 4MHz
- Rcf ≈ 91KΩ

### Library data of the parts
C29 C32 C102 C103 C105 C106 = CAP: 贴片电容
  C29: Link: https://item.szlcsc.com/54083.html
  C102: Link: https://item.szlcsc.com/78065.html
C67 C72 = 0402 100nF (104) 10% 16V: 贴片电容; Value: 4.7uF ±10% 16V; Link: https://item.szlcsc.com/3277786.html
C68-C70 C77 C80 C85 C88 C93 C94 C98 C99 = 0402 100nF (104) 10% 16V: 贴片电容
  C68 C77 C80 C85 C88 C93 C94 C98 C99: Link: https://item.szlcsc.com/456838.html
  C69 C70: Link: https://item.szlcsc.com/315294.html
C71 = 0402 100nF (104) 10% 16V: 贴片电容; Value: 10uF ±10% 25V
C73 = 0402 100nF (104) 10% 16V: 贴片电容; Value: 1uF  ±10% 25V; Link: https://item.szlcsc.com/54083.html
C74 = 0402 100nF (104) 10% 16V: 贴片电容; Value: 1nF,±10% 50V
C75 = 0402 100nF (104) 10% 16V: 贴片电容; Value: 10nF,±10% 50V; ComponentLink1Description: Link; ComponentLink1URL: https://item.szlcsc.com/78065.html
C76 C79 = 0402 100nF (104) 10% 16V: 贴片电容; Value: 33nF,±10% 50V
C78 C86 C95 C100 = 3216 10uF (106) 10% 16V: 贴片电容; Link: https://item.szlcsc.com/60514.html
C81 C89 C97 C101 = 0402 100nF (104) 10% 16V: 贴片电容; Value: 68pF,±10% 16V
C82 C84 C90 C92 = 0402 100nF (104) 10% 16V: 贴片电容; Value: 4.7nF,±10% 16V
C83 C91 = 0402 100nF (104) 10% 16V: 贴片电容; Value: 22pF,±5% 50V
C87 C96 = 0402 100nF (104) 10% 16V: 贴片电容; Value: 22pF,±10% 16V
C104 = CAP: 贴片电容; Value: 0.1uF ±10% 16V; ComponentLink1Description: Link; ComponentLink1URL: https://item.szlcsc.com/456838.html
C107 = CAP: 贴片电容; Value: 18pF ±5% 50V
L1-L4 = INDUCTOR: 功率电感; Link: https://item.szlcsc.com/271084.html
L5 = INDUCTOR: 功率电感; PartNumber: BDCD00201610R47MS1; Link: https://item.szlcsc.com/3012718.html
R24 R55 = RES1: 贴片电阻; Value: 330K,±1%
R25 R26 R28 R30-R33 R36 R40 R43 R44 R46 R50 R51 R53 R54 R56 = RES1: 贴片电阻; Value: 10K,±1%
R27 R29 = RES1: 贴片电阻; Value: 0Ω,±1%
R34 = RES1: 贴片电阻; Value: 1.24K,±1%
R35 R37 R39 R41 = RES1: 贴片电阻; Value: 15.4K,±1%
R38 = RES1: 贴片电阻; Value: 19.1K,±1%
R42 = RES1: 贴片电阻; Value: 53.6K,±1%
R45 = RES1: 贴片电阻; Value: 8.66K,±1%
R47-R49 = RES1: 贴片电阻; Value: 100K，±1%
R52 = RES1: 贴片电阻; Value: 0Ω，±5%
T1 T9-T15 = TP: 测试点; Value: 测试点
U6 = TPS65400RGZT: 电源芯片; MF: Texas Instruments; Value: TPS65400RGZT; SnapEDA_Link: https://www.snapeda.com/parts/TPS65400RGZT/Texas%20Instruments/view-part/?ref=snap; Availability: Good; Price: 3.95 USD; Package: VQFN-48 Texas Instruments; MP: TPS65400RGZT
U7 = TPS628501: 电源芯片
U8 = TPS793-XX: 电源芯片
U9 = LM3880MF-1AA: 时序排序器; Value: LM3880MF-1AA

## Sheet T35_4_FX3.SchDoc
size A3
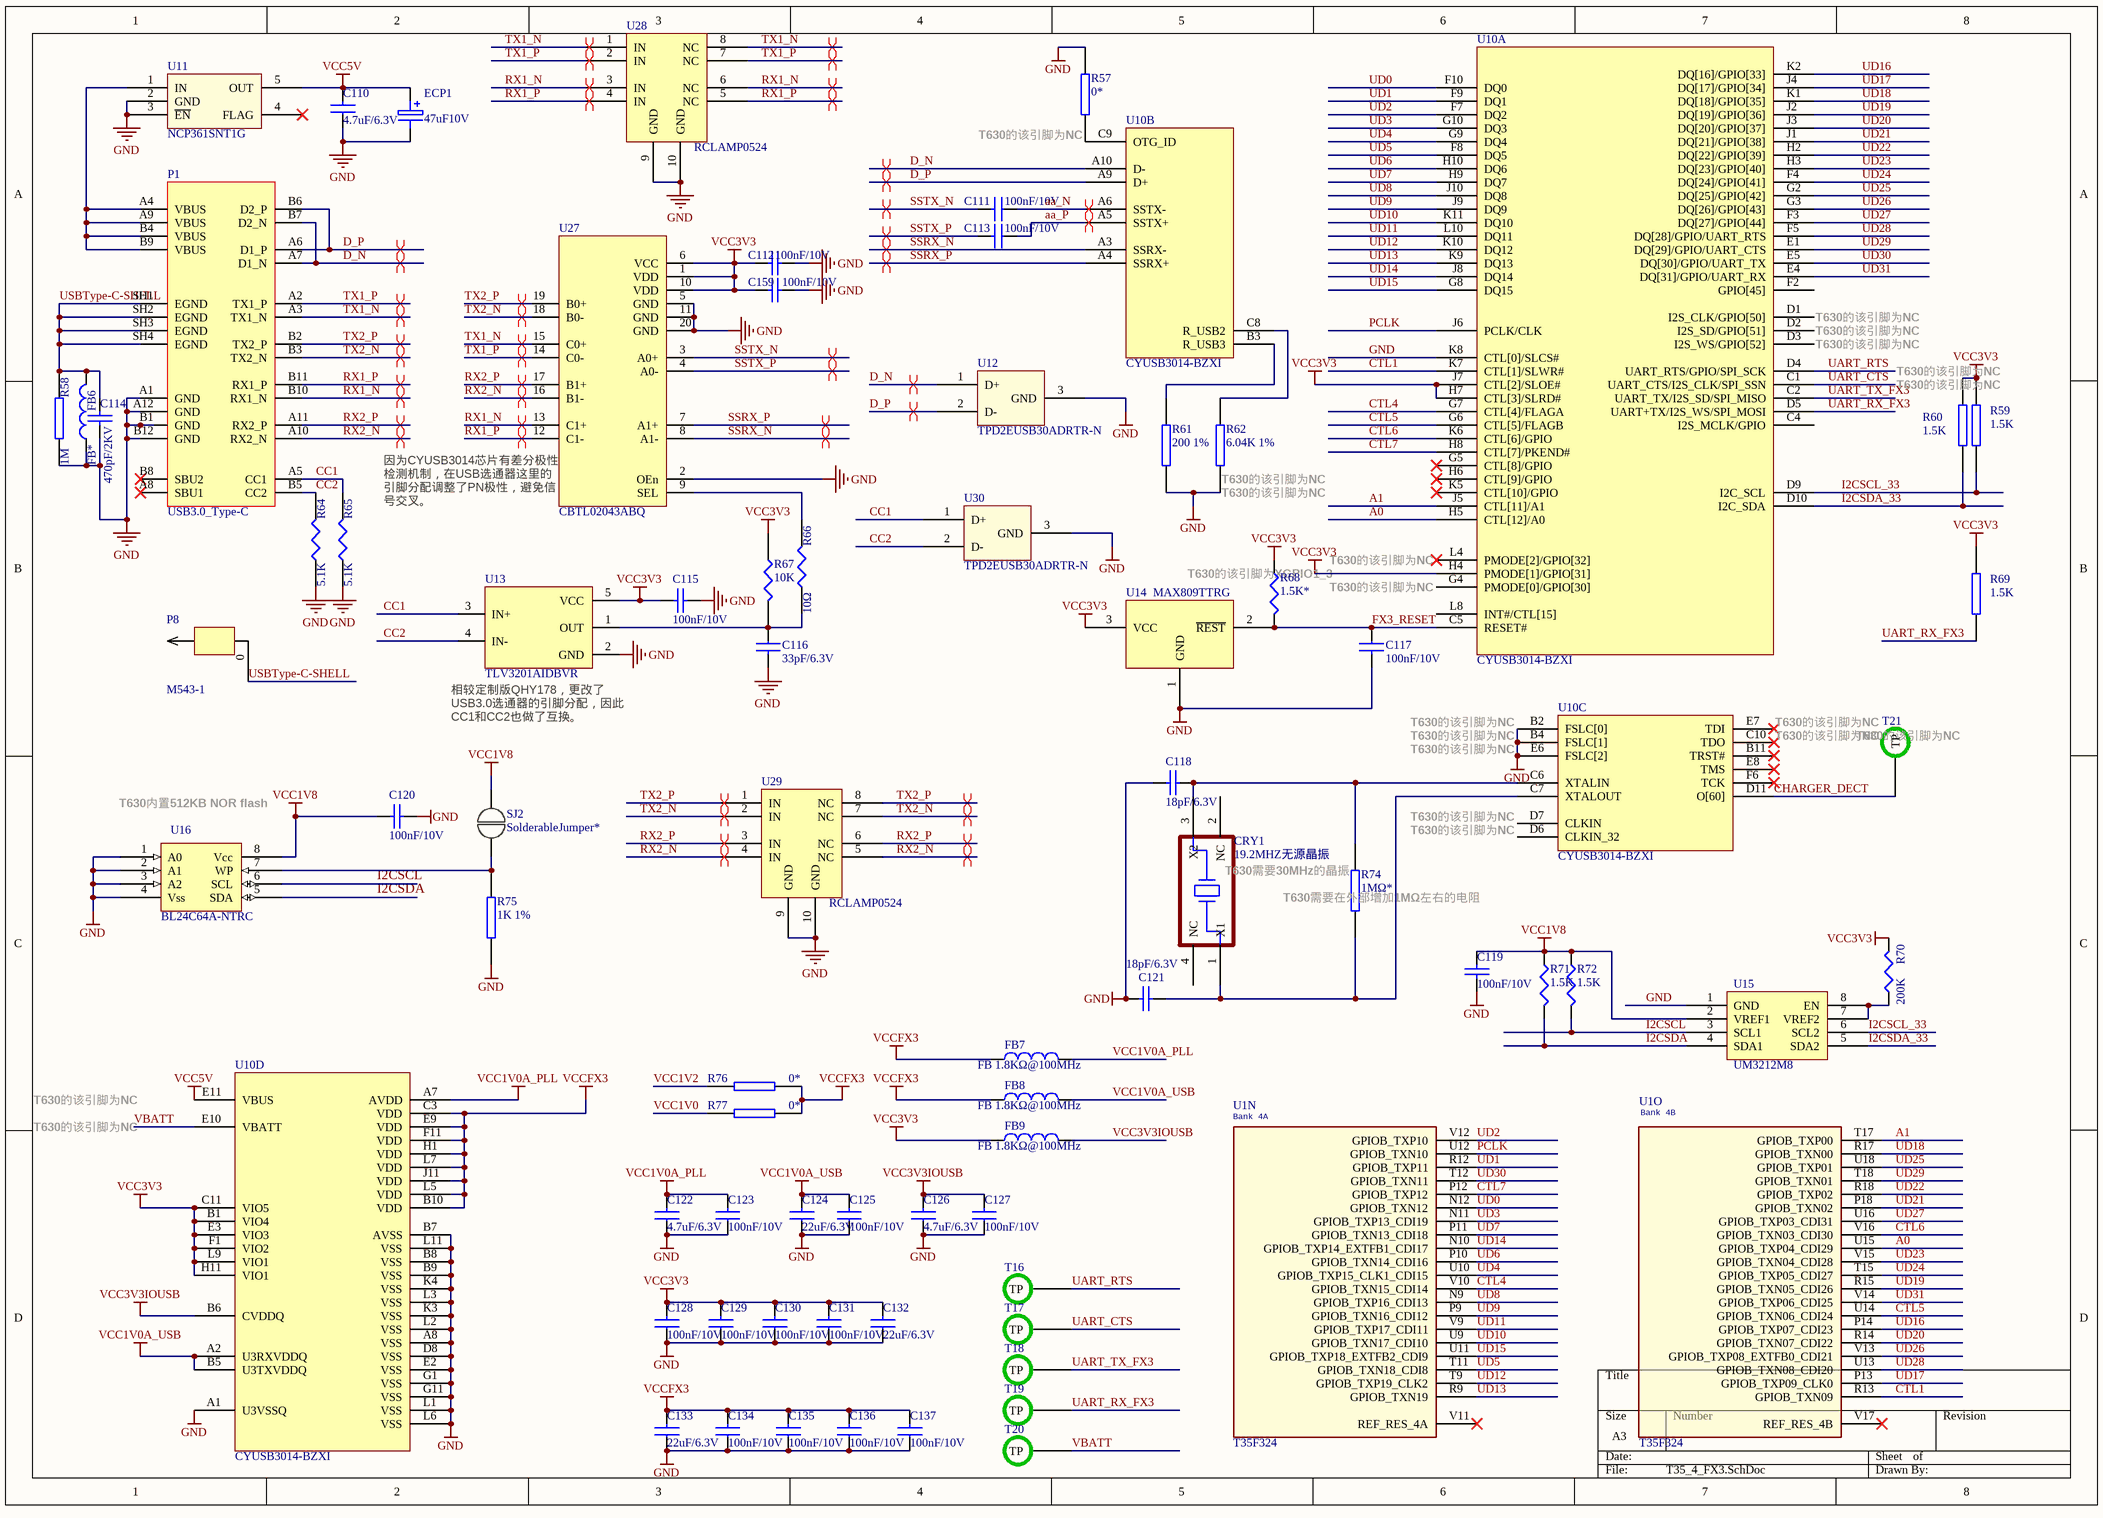
[diagram p4: T35_4_FX3.SchDoc]

### Parts
C110  4.7uF/6.3V  [0402CS]
C111  100nF/10V  [0201CS]
C112  100nF/10V  [0201CS]
C113  100nF/10V  [0201CS]
C114  470pF/2KV  [1206CS]
C115  100nF/10V  [0201CS]
C116  33pF/6.3V  [0402CS]
C117  100nF/10V  [0201CS]
C118  18pF/6.3V  [0201CS]
C119  100nF/10V  [0201CS]
C120  100nF/10V  [0201CS]
C121  18pF/6.3V  [0201CS]
C122  4.7uF/6.3V  [0402CS]
C123  100nF/10V  [0201CS]
C124  22uF/6.3V  [0603CS]
C125  100nF/10V  [0201CS]
C126  4.7uF/6.3V  [0402CS]
C127  100nF/10V  [0201CS]
C128  100nF/10V  [0201CS]
C129  100nF/10V  [0201CS]
C130  100nF/10V  [0201CS]
C131  100nF/10V  [0201CS]
C132  22uF/6.3V  [0603CS]
C133  22uF/6.3V  [0603CS]
C134  100nF/10V  [0201CS]
C135  100nF/10V  [0201CS]
C136  100nF/10V  [0201CS]
C137  100nF/10V  [0201CS]
C159  100nF/10V  [0201CS]
CRY1  19.2MHZ无源晶振  [XTAL_SMD_SMALL]
ECP1  47uF10V  [CASE-B]
FB6  FB*  [FB0603]
FB7  FB 1.8KΩ@100MHz  [FB0603]
FB8  FB 1.8KΩ@100MHz  [FB0603]
FB9  FB 1.8KΩ@100MHz  [FB0603]
P1  USB3.0_Type-C  [CONN_105450-0101_MOL - duplicate]
P8  M543-1  [M543-1]
R57  0*  [0201RS]
R58  1M  [0603RS]
R59  1.5K  [0402RS]
R60  1.5K  [0402RS]
R61  200 1%  [0402RS]
R62  6.04K 1%  [0402RS]
R64  5.1K  [0201RS]
R65  5.1K  [0201RS]
R66  10Ω  [0402RS]
R67  10K  [0201RS]
R68  1.5K*  [0402RS]
R69  1.5K  [0402RS]
R70  200K  [0201RS]
R71  1.5K  [0402RS]
R72  1.5K  [0402RS]
R74  1MΩ*  [0402RS]
R75  1K 1%  [0402RS]
R76  0*  [0402RS]
R77  0*  [0402RS]
SJ2  SolderableJumper*  [SJ]
T16  (no value)  [TP-S]
T17  (no value)  [TP-S]
T18  (no value)  [TP-S]
T19  (no value)  [TP-S]
T20  (no value)  [TP-S]
T21  (no value)  [TP-S]
U1  T35F324  [T35-F324-BGA100P9X9-81A]  (parts N,O of 17)
U10  CYUSB3014-BZXI  [CYUSB3014]  (parts A,B,C,D of 4)
U11  NCP361SNT1G  [SOT-23-5]
U12  TPD2EUSB30ADRTR-N  [DRT0003A]
U13  TLV3201AIDBVR  [sot-23-5]
U14  MAX809TTRG  [MAX809]
U15  UM3212M8  [MSOP8]
U16  BL24C64A-NTRC  [UDFN-8LL]
U27  CBTL02043ABQ  [VQFN-20]
U28  RCLAMP0524  [RCLAMP0524]
U29  RCLAMP0524  [RCLAMP0524]
U30  TPD2EUSB30ADRTR-N  [DRT0003A]

### Nets
GND: C110.1 C112.1 C114.1 C115.1 C116.2 C117.2 C118.1 C119.2 C120.1 C121.2 C122.1 C123.1 C124.1 C125.1 C126.1 C127.1 C128.1 C129.1 C130.1 C131.1 C132.1 C133.1 C134.1 C135.1 C136.1 C137.1 C159.1 ECP1.2 FB6.1 P1.A1(GND) P1.A12(GND) P1.B1(GND) P1.B12(GND) R57.1 R58.2 R61.2 R62.2 R64.1 R65.1 R75.2 U10.A1(U3VSSQ) U10.A8(VSS) U10.B2(FSLC[0]) U10.B4(FSLC[1]) U10.B7(AVSS) U10.B8(VSS) U10.B9(VSS) U10.D8(VSS) U10.E2(VSS) U10.E6(FSLC[2]) U10.G1(VSS) U10.G11(VSS) U10.K3(VSS) U10.K4(VSS) U10.K8(CTL[0]/SLCS#) U10.L1(VSS) U10.L2(VSS) U10.L3(VSS) U10.L6(VSS) U10.L11(VSS) U11.2(GND) U11.3(~{EN}) U12.3(GND) U13.2(GND) U14.1(GND) U15.1(GND) U16.1(A0) U16.2(A1) U16.3(A2) U16.4(Vss) U27.2(OEn) U27.5(GND) U27.11(GND) U27.20(GND) U28.9(GND) U28.10(GND) U29.9(GND) U29.10(GND) U30.3(GND)
VCC1V0: R77.2
VCC1V0A_PLL: C122.2 C123.2 FB7.2 U10.A7(AVDD)
VCC1V0A_USB: C124.2 C125.2 FB8.2 U10.A2(U3RXVDDQ) U10.B5(U3TXVDDQ)
VCC1V2: R76.2
VCC1V8: C119.1 C120.2 R71.1 R72.1 SJ2.1 U15.2(VREF1) U16.8(Vcc)
VCC3V3: C112.2 C115.2 C128.2 C129.2 C130.2 C131.2 C132.2 C159.2 FB9.1 R59.1 R60.1 R67.1 R68.1 R69.1 R70.2 U10.B1(VIO4) U10.C11(VIO5) U10.E3(VIO3) U10.F1(VIO2) U10.H4(PMODE[1]/GPIO[31]) U10.H7(CTL[3]/SLRD#) U10.H11(VIO1) U10.J7(CTL[2]/SLOE#) U10.L9(VIO1) U13.5(VCC) U14.3(VCC) U27.1(VDD) U27.6(VCC) U27.10(VDD)
VCC3V3IOUSB: C126.2 C127.2 FB9.2 U10.B6(CVDDQ)
VCC5V: C110.2 ECP1.1 U10.E11(VBUS) U11.5(OUT)
VCCFX3: C133.2 C134.2 C135.2 C136.2 C137.2 FB7.1 FB8.1 R76.1 R77.1 U10.B10(VDD) U10.C3(VDD) U10.E9(VDD) U10.F11(VDD) U10.H1(VDD) U10.J11(VDD) U10.L5(VDD) U10.L7(VDD)
A0: U1.U15(GPIOB_TXP04_CDI29) U10.H5(CTL[12]/A0)
A1: U1.T17(GPIOB_TXP00) U10.J5(CTL[11]/A1)
aa_N: C111.1 U10.A6(SSTX-)
aa_P: C113.1 U10.A5(SSTX+)
CC1: P1.A5(CC1) R65.2 U13.3(IN+) U30.1(D+)
CC2: P1.B5(CC2) R64.2 U13.4(IN-) U30.2(D-)
CHARGER_DECT: T21.1(TP) U10.D11(O[60])
CTL1: U1.R13(GPIOB_TXN09) U10.K7(CTL[1]/SLWR#)
CTL4: U1.V10(GPIOB_TXN15_CDI14) U10.G7(CTL[4]/FLAGA)
CTL5: U1.U14(GPIOB_TXN06_CDI24) U10.G6(CTL[5]/FLAGB)
CTL6: U1.V16(GPIOB_TXN03_CDI30) U10.K6(CTL[6]/GPIO)
CTL7: U1.P12(GPIOB_TXP12) U10.H8(CTL[7]/PKEND#)
D_N: P1.A7(D1_N) P1.B7(D2_N) U10.A10(D-) U12.1(D+)
D_P: P1.A6(D1_P) P1.B6(D2_P) U10.A9(D+) U12.2(D-)
FX3_RESET: C117.1 R68.2 U10.C5(RESET#) U14.2(~{REST})
I2CSCL: R72.2 U15.3(SCL1) U16.6(SCL)
I2CSCL_33: R59.2 U10.D9(I2C_SCL) U15.6(SCL2)
I2CSDA: R71.2 U15.4(SDA1) U16.5(SDA)
I2CSDA_33: R60.2 U10.D10(I2C_SDA) U15.5(SDA2)
PCLK: U1.U12(GPIOB_TXN10) U10.J6(PCLK/CLK)
RX1_N: P1.B10(RX1_N) U27.13(C1+) U28.3(IN) U28.6(NC)
RX1_P: P1.B11(RX1_P) U27.12(C1-) U28.4(IN) U28.5(NC)
RX2_N: P1.A10(RX2_N) U27.16(B1-) U29.4(IN) U29.5(NC)
RX2_P: P1.A11(RX2_P) U27.17(B1+) U29.3(IN) U29.6(NC)
SSRX_N: U10.A3(SSRX-) U27.8(A1-)
SSRX_P: U10.A4(SSRX+) U27.7(A1+)
SSTX_N: C111.2 U27.3(A0+)
SSTX_P: C113.2 U27.4(A0-)
TX1_N: P1.A3(TX1_N) U27.15(C0+) U28.1(IN) U28.8(NC)
TX1_P: P1.A2(TX1_P) U27.14(C0-) U28.2(IN) U28.7(NC)
TX2_N: P1.B3(TX2_N) U27.18(B0-) U29.2(IN) U29.7(NC)
TX2_P: P1.B2(TX2_P) U27.19(B0+) U29.1(IN) U29.8(NC)
UART_CTS: T17.1(TP) U10.C1(UART_CTS/I2S_CLK/SPI_SSN)
UART_RTS: T16.1(TP) U10.D4(UART_RTS/GPIO/SPI_SCK)
UART_RX_FX3: R69.2 T19.1(TP) U10.D5(UART+TX/I2S_WS/SPI_MOSI)
UART_TX_FX3: T18.1(TP) U10.C2(UART_TX/I2S_SD/SPI_MISO)
UD0: U1.N12(GPIOB_TXN12) U10.F10(DQ0)
UD1: U1.R12(GPIOB_TXP11) U10.F9(DQ1)
UD2: U1.V12(GPIOB_TXP10) U10.F7(DQ2)
UD3: U1.N11(GPIOB_TXP13_CDI19) U10.G10(DQ3)
UD4: U1.U10(GPIOB_TXP15_CLK1_CDI15) U10.G9(DQ4)
UD5: U1.T11(GPIOB_TXN18_CDI8) U10.F8(DQ5)
UD6: U1.P10(GPIOB_TXN14_CDI16) U10.H10(DQ6)
UD7: U1.P11(GPIOB_TXN13_CDI18) U10.H9(DQ7)
UD8: U1.N9(GPIOB_TXP16_CDI13) U10.J10(DQ8)
UD9: U1.P9(GPIOB_TXN16_CDI12) U10.J9(DQ9)
UD10: U1.U9(GPIOB_TXN17_CDI10) U10.K11(DQ10)
UD11: U1.V9(GPIOB_TXP17_CDI11) U10.L10(DQ11)
UD12: U1.T9(GPIOB_TXP19_CLK2) U10.K10(DQ12)
UD13: U1.R9(GPIOB_TXN19) U10.K9(DQ13)
UD14: U1.N10(GPIOB_TXP14_EXTFB1_CDI17) U10.J8(DQ14)
UD15: U1.U11(GPIOB_TXP18_EXTFB2_CDI9) U10.G8(DQ15)
UD16: U1.P14(GPIOB_TXP07_CDI23) U10.K2(DQ[16]/GPIO[33])
UD17: U1.P13(GPIOB_TXP09_CLK0) U10.J4(DQ[17]/GPIO[34])
UD18: U1.R17(GPIOB_TXN00) U10.K1(DQ[18]/GPIO[35])
UD19: U1.R15(GPIOB_TXN05_CDI26) U10.J2(DQ[19]/GPIO[36])
UD20: U1.R14(GPIOB_TXN07_CDI22) U10.J3(DQ[20]/GPIO[37])
UD21: U1.P18(GPIOB_TXN02) U10.J1(DQ[21]/GPIO[38])
UD22: U1.R18(GPIOB_TXP02) U10.H2(DQ[22]/GPIO[39])
UD23: U1.V15(GPIOB_TXN04_CDI28) U10.H3(DQ[23]/GPIO[40])
UD24: U1.T15(GPIOB_TXP05_CDI27) U10.F4(DQ[24]/GPIO[41])
UD25: U1.U18(GPIOB_TXP01) U10.G2(DQ[25]/GPIO[42])
UD26: U1.V13(GPIOB_TXP08_EXTFB0_CDI21) U10.G3(DQ[26]/GPIO[43])
UD27: U1.U16(GPIOB_TXP03_CDI31) U10.F3(DQ[27]/GPIO[44])
UD28: U1.U13(GPIOB_TXN08_CDI20) U10.F5(DQ[28]/GPIO/UART_RTS)
UD29: U1.T18(GPIOB_TXN01) U10.E1(DQ[29]/GPIO/UART_CTS)
UD30: U1.T12(GPIOB_TXN11) U10.E5(DQ[30]/GPIO/UART_TX)
UD31: U1.V14(GPIOB_TXP06_CDI25) U10.E4(DQ[31]/GPIO/UART_RX)
USBType-C-SHELL: C114.2 FB6.2 P1.SH1(EGND) P1.SH2(EGND) P1.SH3(EGND) P1.SH4(EGND) P8.0 R58.1
VBATT: T20.1(TP) U10.E10(VBATT)
NetC116_1: C116.1 R66.1 R67.2 U13.1(OUT)
NetC118_2: C118.2 CRY1.3(X2) R74.1 U10.C6(XTALIN)
NetC121_1: C121.1 CRY1.1(X1) R74.2 U10.C7(XTALOUT)
NetP1_A4: P1.A4(VBUS) P1.A9(VBUS) P1.B4(VBUS) P1.B9(VBUS) U11.1(IN)
NetR57_2: R57.2 U10.C9(OTG_ID)
NetR61_1: R61.1 U10.B3(R_USB3)
NetR62_1: R62.1 U10.C8(R_USB2)
NetR66_2: R66.2 U27.9(SEL)
NetR70_1: R70.1 U15.7(VREF2) U15.8(EN)
NetR75_1: R75.1 SJ2.2 U16.7(WP)

Not connected (* = marked no-connect by the designer): CRY1 2(NC) 4(NC); P1 A8(SBU1)* B8(SBU2)*; U1 V11(REF_RES_4A)* V17(REF_RES_4B)*; U10 B11(TRST#)* C4(I2S_MCLK/GPIO) C10(TDO)* D1(I2S_CLK/GPIO[50]) D2(I2S_SD/GPIO[51]) D3(I2S_WS/GPIO[52]) D6(CLKIN_32) D7(CLKIN) E7(TDI)* E8(TMS)* F2(GPIO[45]) F6(TCK)* G4(PMODE[0]/GPIO[30]) G5(CTL[8]/GPIO)* H6(CTL[9]/GPIO)* K5(CTL[10]/GPIO)* L4(PMODE[2]/GPIO[32])* L8(INT#/CTL[15]); U11 4(FLAG)*

### Layout directives
differential pair: aa_N, aa_P, D_N, D_P, RX1_N, RX1_P, RX2_N, RX2_P, SSRX_N, SSRX_P, SSTX_N, SSTX_P, TX1_N, TX1_P, TX2_N, TX2_P

### Notes on the sheet
- (near R57) T630的该引脚为NC
- T630的该引脚为NC
- (near U27) 因为CYUSB3014芯片有差分极性检测机制，在USB选通器这里的引脚分配调整了PN极性，避免信号交叉。
- (near R62) T630的该引脚为NC
- (near R68) T630的该引脚为XGPIO1_3
- (near U13) 相较定制版QHY178，更改了USB3.0选通器的引脚分配，因此CC1和CC2也做了互换。
- (near T21) T630的该引脚为NC
- (near U16) T630内置512KB NOR flash
- T630需要30MHz的晶振
- (near R74) T630需要在外部增加1MΩ左右的电阻
- (in symbol T35F324, part N) Bank 4A
- (in symbol T35F324, part O) Bank 4B

### Library data of the parts
C110 C117 C122-C137 = CAPACITOR NON-POL: 贴片电容
  C110 C122 C126: Link: https://item.szlcsc.com/3277786.html
  C117 C123 C125 C127-C131 C134-C137: Link: https://item.szlcsc.com/456838.html
  C124 C132 C133: Link: https://item.szlcsc.com/60514.html
C111 C113 C116 = CAPACITOR NON-POL: 贴片电容; Text Field1: 20; Text Field2: 10
  C111 C113: Link: https://item.szlcsc.com/456838.html
C112 C114 C115 C118 C120 C121 C159 = CAP: 贴片电容
  C112 C115 C120 C159: Link: https://item.szlcsc.com/456838.html
  C114: ComponentLink1Description: Link; ComponentLink1URL: https://item.szlcsc.com/3348367.html
C119 = CAP: 贴片电容; Value: 0.1uF ±10% 16V; ComponentLink1Description: Link; ComponentLink1URL: https://item.szlcsc.com/456838.html
CRY1 = CRY-4S: 无源晶振
ECP1 = ELECTRO1: 钽电容
FB6 = INDUCTOR: 贴片磁珠; Value: BLM18SG331TN1
FB7-FB9 = Inductor: 贴片磁珠; Link: https://item.szlcsc.com/373740.html
P1 = USB3.0_Type-C: USB Type-C连接器
P8 = M543-1: 弹簧针
R57-R62 R69 R74-R77 = RES2: 贴片电阻
R64 R65 = RES1: 贴片电阻; Value: 5.1K，±1%
R66 = RES1: 贴片电阻; Value: 10Ω，±1%
R67 = RES1: 贴片电阻; Value: 10K，±1%
R68 R71 R72 = Res3: 贴片电阻; Value: 1.5K ±1%; Published: 8-Jun-2000; LatestRevisionDate: 29-May-2009; LatestRevisionNote: IPC-7351 Footprint Added.; PackageReference: J1-0603; Publisher: Altium Limited; PackageDescription: Chip Resistor
R70 = Res3: 贴片电阻; Value: 200K ±1%; Published: 8-Jun-2000; LatestRevisionDate: 29-May-2009; LatestRevisionNote: IPC-7351 Footprint Added.; PackageReference: J1-0603; Publisher: Altium Limited; PackageDescription: Chip Resistor
SJ2 = SolderableJumper
T16-T21 = TP: 测试点
U1 = T35F324: as U1 on sheet T35_1_IO
U10 = CYUSB3014: FX3芯片
U11 = NCP361SNT1G: USB过压过流保护芯片
U12 U30 = TPD2EUSB30ADRTR-N: ESD保护器件
U13 = TLV3201AIDBVR: 比较器; Value: TLV3201AIDBVR
U14 = MAX809: 复位芯片
U15 = UM3212M8: I2C电平转换芯片; Value: UM3212MB
U16 = 24LC00: EEPROM芯片; Text Field1: 60; Text Field2: 50
U27 = CBTL02043ABQ: USB3.0选通芯片; Value: HD3SS3212RKSR
U28 U29 = RCLAMP0524: ESD保护器件

## Sheet T35_5_MIPI.SchDoc
size A4
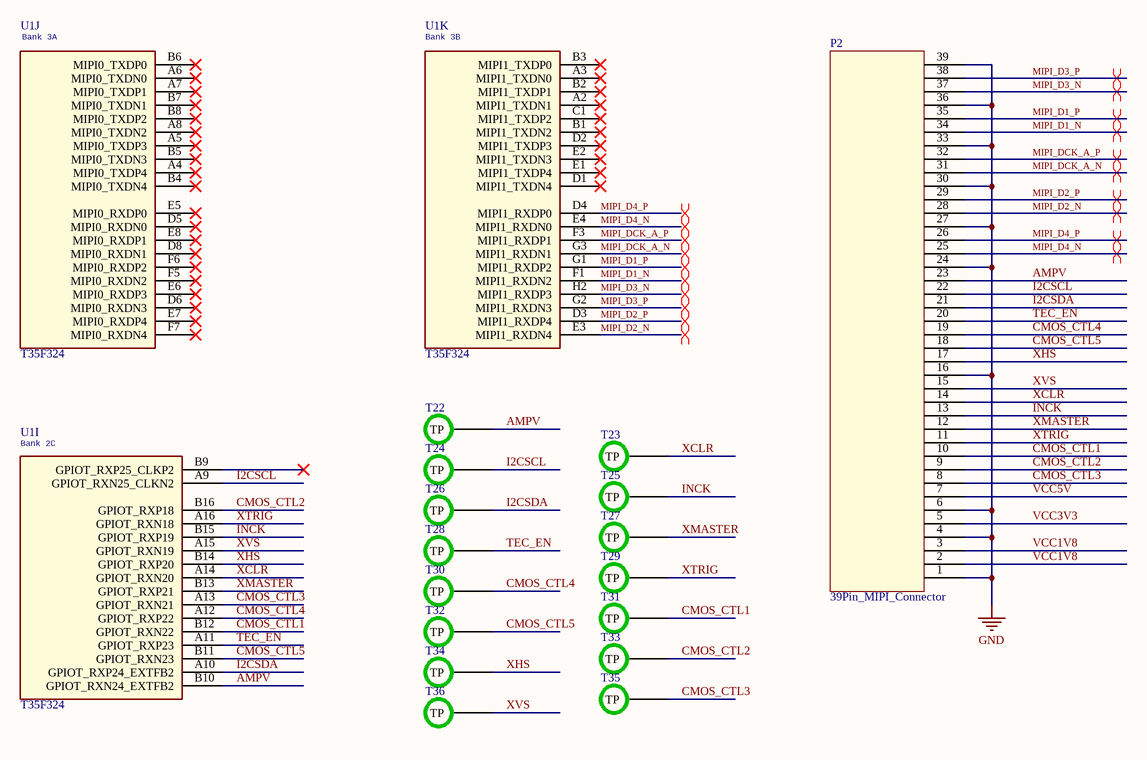
[diagram p5: T35_5_MIPI.SchDoc]

### Parts
P2  39Pin_MIPI_Connector  [39pin_0.3错位排序]
T22  (no value)  [TP-S]
T23  (no value)  [TP-S]
T24  (no value)  [TP-S]
T25  (no value)  [TP-S]
T26  (no value)  [TP-S]
T27  (no value)  [TP-S]
T28  (no value)  [TP-S]
T29  (no value)  [TP-S]
T30  (no value)  [TP-S]
T31  (no value)  [TP-S]
T32  (no value)  [TP-S]
T33  (no value)  [TP-S]
T34  (no value)  [TP-S]
T35  (no value)  [TP-S]
T36  (no value)  [TP-S]
U1  T35F324  [T35-F324-BGA100P9X9-81A]  (parts I,J,K of 17)

### Nets
GND: P2.1 P2.4 P2.6 P2.16 P2.24 P2.27 P2.30 P2.33 P2.36 P2.39
VCC1V8: P2.2 P2.3
VCC3V3: P2.5
VCC5V: P2.7
AMPV: P2.23 T22.1(TP) U1.B10(GPIOT_RXN24_EXTFB2)
CMOS_CTL1: P2.10 T31.1(TP) U1.B12(GPIOT_RXN22)
CMOS_CTL2: P2.9 T33.1(TP) U1.B16(GPIOT_RXP18)
CMOS_CTL3: P2.8 T35.1(TP) U1.A13(GPIOT_RXN21)
CMOS_CTL4: P2.19 T30.1(TP) U1.A12(GPIOT_RXP22)
CMOS_CTL5: P2.18 T32.1(TP) U1.B11(GPIOT_RXN23)
I2CSCL: P2.22 T24.1(TP) U1.A9(GPIOT_RXN25_CLKN2)
I2CSDA: P2.21 T26.1(TP) U1.A10(GPIOT_RXP24_EXTFB2)
INCK: P2.13 T25.1(TP) U1.B15(GPIOT_RXP19)
MIPI_D1_N: P2.34 U1.F1(MIPI1_RXDN2)
MIPI_D1_P: P2.35 U1.G1(MIPI1_RXDP2)
MIPI_D2_N: P2.28 U1.E3(MIPI1_RXDN4)
MIPI_D2_P: P2.29 U1.D3(MIPI1_RXDP4)
MIPI_D3_N: P2.37 U1.H2(MIPI1_RXDP3)
MIPI_D3_P: P2.38 U1.G2(MIPI1_RXDN3)
MIPI_D4_N: P2.25 U1.E4(MIPI1_RXDN0)
MIPI_D4_P: P2.26 U1.D4(MIPI1_RXDP0)
MIPI_DCK_A_N: P2.31 U1.G3(MIPI1_RXDN1)
MIPI_DCK_A_P: P2.32 U1.F3(MIPI1_RXDP1)
TEC_EN: P2.20 T28.1(TP) U1.A11(GPIOT_RXP23)
XCLR: P2.14 T23.1(TP) U1.A14(GPIOT_RXN20)
XHS: P2.17 T34.1(TP) U1.B14(GPIOT_RXP20)
XMASTER: P2.12 T27.1(TP) U1.B13(GPIOT_RXP21)
XTRIG: P2.11 T29.1(TP) U1.A16(GPIOT_RXN18)
XVS: P2.15 T36.1(TP) U1.A15(GPIOT_RXN19)

Not connected (* = marked no-connect by the designer): U1 A2(MIPI1_TXDN1)* A3(MIPI1_TXDN0)* A4(MIPI0_TXDP4)* A5(MIPI0_TXDP3)* A6(MIPI0_TXDN0)* A7(MIPI0_TXDP1)* A8(MIPI0_TXDN2)* B1(MIPI1_TXDN2)* B2(MIPI1_TXDP1)* B3(MIPI1_TXDP0)* B4(MIPI0_TXDN4)* B5(MIPI0_TXDN3)* B6(MIPI0_TXDP0)* B7(MIPI0_TXDN1)* B8(MIPI0_TXDP2)* B9(GPIOT_RXP25_CLKP2)* C1(MIPI1_TXDP2)* D1(MIPI1_TXDN4)* D2(MIPI1_TXDP3)* D5(MIPI0_RXDN0)* D6(MIPI0_RXDN3)* D8(MIPI0_RXDN1)* E1(MIPI1_TXDP4)* E2(MIPI1_TXDN3)* E5(MIPI0_RXDP0)* E6(MIPI0_RXDP3)* E7(MIPI0_RXDP4)* E8(MIPI0_RXDP1)* F5(MIPI0_RXDN2)* F6(MIPI0_RXDP2)* F7(MIPI0_RXDN4)*

### Layout directives
differential pair: MIPI_D1_N, MIPI_D1_P, MIPI_D2_N, MIPI_D2_P, MIPI_D3_N, MIPI_D3_P, MIPI_D4_N, MIPI_D4_P, MIPI_DCK_A_N, MIPI_DCK_A_P

### Notes on the sheet
- (in symbol T35F324, part I) Bank 2C
- (in symbol T35F324, part J) Bank 3A
- (in symbol T35F324, part K) Bank 3B

### Library data of the parts
P2 = 39Pin_MIPI_Connector: 0.3mm间距39PinFPC插座
T22-T36 = TP: 测试点
U1 = T35F324: as U1 on sheet T35_1_IO

## Sheet T35_6_DDR3.SchDoc
size A4
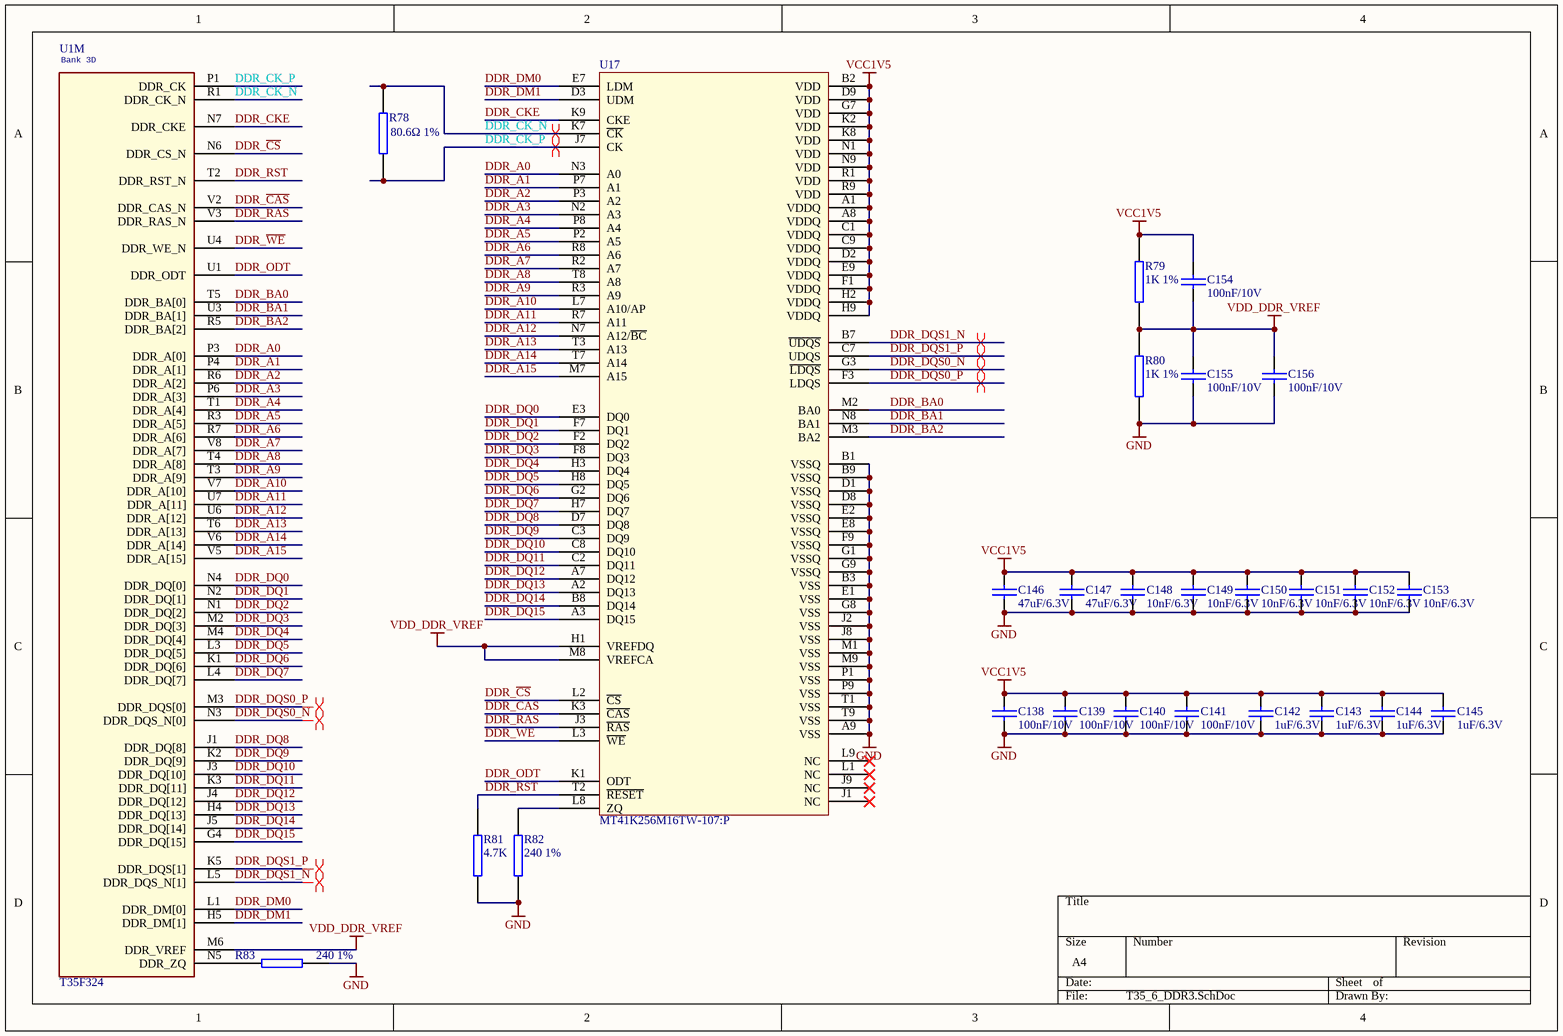
[diagram p6: T35_6_DDR3.SchDoc]

### Parts
C138  100nF/10V  [0201CS]
C139  100nF/10V  [0201CS]
C140  100nF/10V  [0201CS]
C141  100nF/10V  [0201CS]
C142  1uF/6.3V  [0201CS]
C143  1uF/6.3V  [0201CS]
C144  1uF/6.3V  [0201CS]
C145  1uF/6.3V  [0201CS]
C146  47uF/6.3V  [0603CS]
C147  47uF/6.3V  [0603CS]
C148  10nF/6.3V  [0201CS]
C149  10nF/6.3V  [0201CS]
C150  10nF/6.3V  [0201CS]
C151  10nF/6.3V  [0201CS]
C152  10nF/6.3V  [0201CS]
C153  10nF/6.3V  [0201CS]
C154  100nF/10V  [0201CS]
C155  100nF/10V  [0201CS]
C156  100nF/10V  [0201CS]
R78  80.6Ω 1%  [0402RS]
R79  1K 1%  [0402RS]
R80  1K 1%  [0402RS]
R81  4.7K  [0402RS]
R82  240 1%  [0201RS]
R83  240 1%  [0201RS]
U1  T35F324  [T35-F324-BGA100P9X9-81A]  (part M of 17)
U17  MT41K256M16TW-107:P  [MICT-TNA-96]

### Nets
GND: C138.2 C139.2 C140.2 C141.2 C142.2 C143.2 C144.2 C145.2 C146.2 C147.2 C148.2 C149.2 C150.2 C151.2 C152.2 C153.2 C155.2 C156.2 R80.1 R81.2 R82.2 R83.2 U17.A9(VSS) U17.B1(VSSQ) U17.B3(VSS) U17.B9(VSSQ) U17.D1(VSSQ) U17.D8(VSSQ) U17.E1(VSS) U17.E2(VSSQ) U17.E8(VSSQ) U17.F9(VSSQ) U17.G1(VSSQ) U17.G8(VSS) U17.G9(VSSQ) U17.J2(VSS) U17.J8(VSS) U17.M1(VSS) U17.M9(VSS) U17.P1(VSS) U17.P9(VSS) U17.T1(VSS) U17.T9(VSS)
VCC1V5: C138.1 C139.1 C140.1 C141.1 C142.1 C143.1 C144.1 C145.1 C146.1 C147.1 C148.1 C149.1 C150.1 C151.1 C152.1 C153.1 C154.1 R79.2 U17.A1(VDDQ) U17.A8(VDDQ) U17.B2(VDD) U17.C1(VDDQ) U17.C9(VDDQ) U17.D2(VDDQ) U17.D9(VDD) U17.E9(VDDQ) U17.F1(VDDQ) U17.G7(VDD) U17.H2(VDDQ) U17.H9(VDDQ) U17.K2(VDD) U17.K8(VDD) U17.N1(VDD) U17.N9(VDD) U17.R1(VDD) U17.R9(VDD)
VDD_DDR_VREF: C154.2 C155.1 C156.1 R79.1 R80.2 U1.M6(DDR_VREF) U17.H1(VREFDQ) U17.M8(VREFCA)
DDR_A0: U1.P3(DDR_A[0]) U17.N3(A0)
DDR_A1: U1.P4(DDR_A[1]) U17.P7(A1)
DDR_A2: U1.R6(DDR_A[2]) U17.P3(A2)
DDR_A3: U1.P6(DDR_A[3]) U17.N2(A3)
DDR_A4: U1.T1(DDR_A[4]) U17.P8(A4)
DDR_A5: U1.R3(DDR_A[5]) U17.P2(A5)
DDR_A6: U1.R7(DDR_A[6]) U17.R8(A6)
DDR_A7: U1.V8(DDR_A[7]) U17.R2(A7)
DDR_A8: U1.T4(DDR_A[8]) U17.T8(A8)
DDR_A9: U1.T3(DDR_A[9]) U17.R3(A9)
DDR_A10: U1.V7(DDR_A[10]) U17.L7(A10/AP)
DDR_A11: U1.U7(DDR_A[11]) U17.R7(A11)
DDR_A12: U1.U6(DDR_A[12]) U17.N7(A12/~{BC})
DDR_A13: U1.T6(DDR_A[13]) U17.T3(A13)
DDR_A14: U1.V6(DDR_A[14]) U17.T7(A14)
DDR_A15: U1.V5(DDR_A[15]) U17.M7(A15)
DDR_BA0: U1.T5(DDR_BA[0]) U17.M2(BA0)
DDR_BA1: U1.U3(DDR_BA[1]) U17.N8(BA1)
DDR_BA2: U1.R5(DDR_BA[2]) U17.M3(BA2)
DDR_~{CAS}: U1.V2(DDR_CAS_N) U17.K3(~{CAS})
DDR_~{CS}: U1.N6(DDR_CS_N) U17.L2(~{CS})
DDR_CK_N: R78.1 U1.R1(DDR_CK_N) U17.K7(~{CK})
DDR_CK_P: R78.2 U1.P1(DDR_CK) U17.J7(CK)
DDR_CKE: U1.N7(DDR_CKE) U17.K9(CKE)
DDR_DM0: U1.L1(DDR_DM[0]) U17.E7(LDM)
DDR_DM1: U1.H5(DDR_DM[1]) U17.D3(UDM)
DDR_DQ0: U1.N4(DDR_DQ[0]) U17.E3(DQ0)
DDR_DQ1: U1.N2(DDR_DQ[1]) U17.F7(DQ1)
DDR_DQ2: U1.N1(DDR_DQ[2]) U17.F2(DQ2)
DDR_DQ3: U1.M2(DDR_DQ[3]) U17.F8(DQ3)
DDR_DQ4: U1.M4(DDR_DQ[4]) U17.H3(DQ4)
DDR_DQ5: U1.L3(DDR_DQ[5]) U17.H8(DQ5)
DDR_DQ6: U1.K1(DDR_DQ[6]) U17.G2(DQ6)
DDR_DQ7: U1.L4(DDR_DQ[7]) U17.H7(DQ7)
DDR_DQ8: U1.J1(DDR_DQ[8]) U17.D7(DQ8)
DDR_DQ9: U1.K2(DDR_DQ[9]) U17.C3(DQ9)
DDR_DQ10: U1.J3(DDR_DQ[10]) U17.C8(DQ10)
DDR_DQ11: U1.K3(DDR_DQ[11]) U17.C2(DQ11)
DDR_DQ12: U1.J4(DDR_DQ[12]) U17.A7(DQ12)
DDR_DQ13: U1.H4(DDR_DQ[13]) U17.A2(DQ13)
DDR_DQ14: U1.J5(DDR_DQ[14]) U17.B8(DQ14)
DDR_DQ15: U1.G4(DDR_DQ[15]) U17.A3(DQ15)
DDR_DQS0_N: U1.N3(DDR_DQS_N[0]) U17.G3(~{LDQS})
DDR_DQS0_P: U1.M3(DDR_DQS[0]) U17.F3(LDQS)
DDR_DQS1_N: U1.L5(DDR_DQS_N[1]) U17.B7(~{UDQS})
DDR_DQS1_P: U1.K5(DDR_DQS[1]) U17.C7(UDQS)
DDR_ODT: U1.U1(DDR_ODT) U17.K1(ODT)
DDR_~{RAS}: U1.V3(DDR_RAS_N) U17.J3(~{RAS})
DDR_RST: R81.1 U1.T2(DDR_RST_N) U17.T2(~{RESET})
DDR_~{WE}: U1.U4(DDR_WE_N) U17.L3(~{WE})
NetR82_1: R82.1 U17.L8(ZQ)
NetR83_1: R83.1 U1.N5(DDR_ZQ)

Not connected (* = marked no-connect by the designer): U17 J1(NC)* J9(NC)* L1(NC)* L9(NC)*

### Layout directives
differential pair: DDR_CK_N, DDR_CK_P, DDR_DQS0_N, DDR_DQS0_P, DDR_DQS1_N, DDR_DQS1_P

### Notes on the sheet
- (in symbol T35F324, part M) Bank 3D

### Library data of the parts
C138-C156 = CAP: 贴片电容
  C138-C141 C154-C156: Link: https://item.szlcsc.com/456838.html
  C142-C145: Link: https://item.szlcsc.com/54083.html
  C146 C147: Link: https://item.szlcsc.com/152108.html
  C148-C153: Link: https://item.szlcsc.com/78065.html
R78-R83 = RES2: 贴片电阻
U1 = T35F324: as U1 on sheet T35_1_IO
U17 = MT41K512M16HA-125IT: DDR3芯片

## Sheet T35_7_MEMORY.SchDoc
size A4
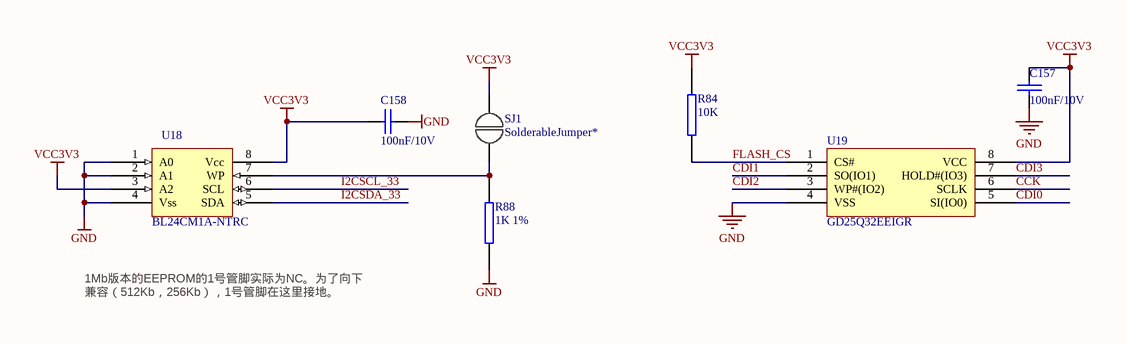
[diagram p7: T35_7_MEMORY.SchDoc]

### Parts
C157  100nF/10V  [0201CS]
C158  100nF/10V  [0201CS]
R84  10K  [0201RS]
R88  1K 1%  [0402RS]
SJ1  SolderableJumper*  [SJ]
U18  BL24CM1A-NTRC  [UDFN-8LL]
U19  GD25Q32EEIGR  [SON127P600-8N-USON8]

### Nets
GND: C157.2 C158.1 R88.2 U18.1(A0) U18.2(A1) U18.4(Vss) U19.4(VSS)
VCC3V3: C157.1 C158.2 R84.2 SJ1.1 U18.3(A2) U18.8(Vcc) U19.8(VCC)
CCK: U19.6(SCLK)
CDI0: U19.5(SI(IO0))
CDI1: U19.2(SO(IO1))
CDI2: U19.3(WP#(IO2))
CDI3: U19.7(HOLD#(IO3))
FLASH_CS: R84.1 U19.1(CS#)
I2CSCL_33: U18.6(SCL)
I2CSDA_33: U18.5(SDA)
NetR88_1: R88.1 SJ1.2 U18.7(WP)

### Notes on the sheet
- 1Mb版本的EEPROM的1号管脚实际为NC。为了向下兼容（512Kb，256Kb），1号管脚在这里接地。

### Library data of the parts
C157 = CAP: 贴片电容; Value: 0.1uF ±10% 16V; Link: https://item.szlcsc.com/456838.html
C158 = CAP: 贴片电容; Link: https://item.szlcsc.com/456838.html
R84 R88 = RES2: 贴片电阻
SJ1 = SolderableJumper
U18 = 24LC00: as U16 on sheet T35_4_FX3
U19 = GD25Q64ESIG: SPI Flash

## Sheet T35_8_CONNECTORS.SchDoc
size A4
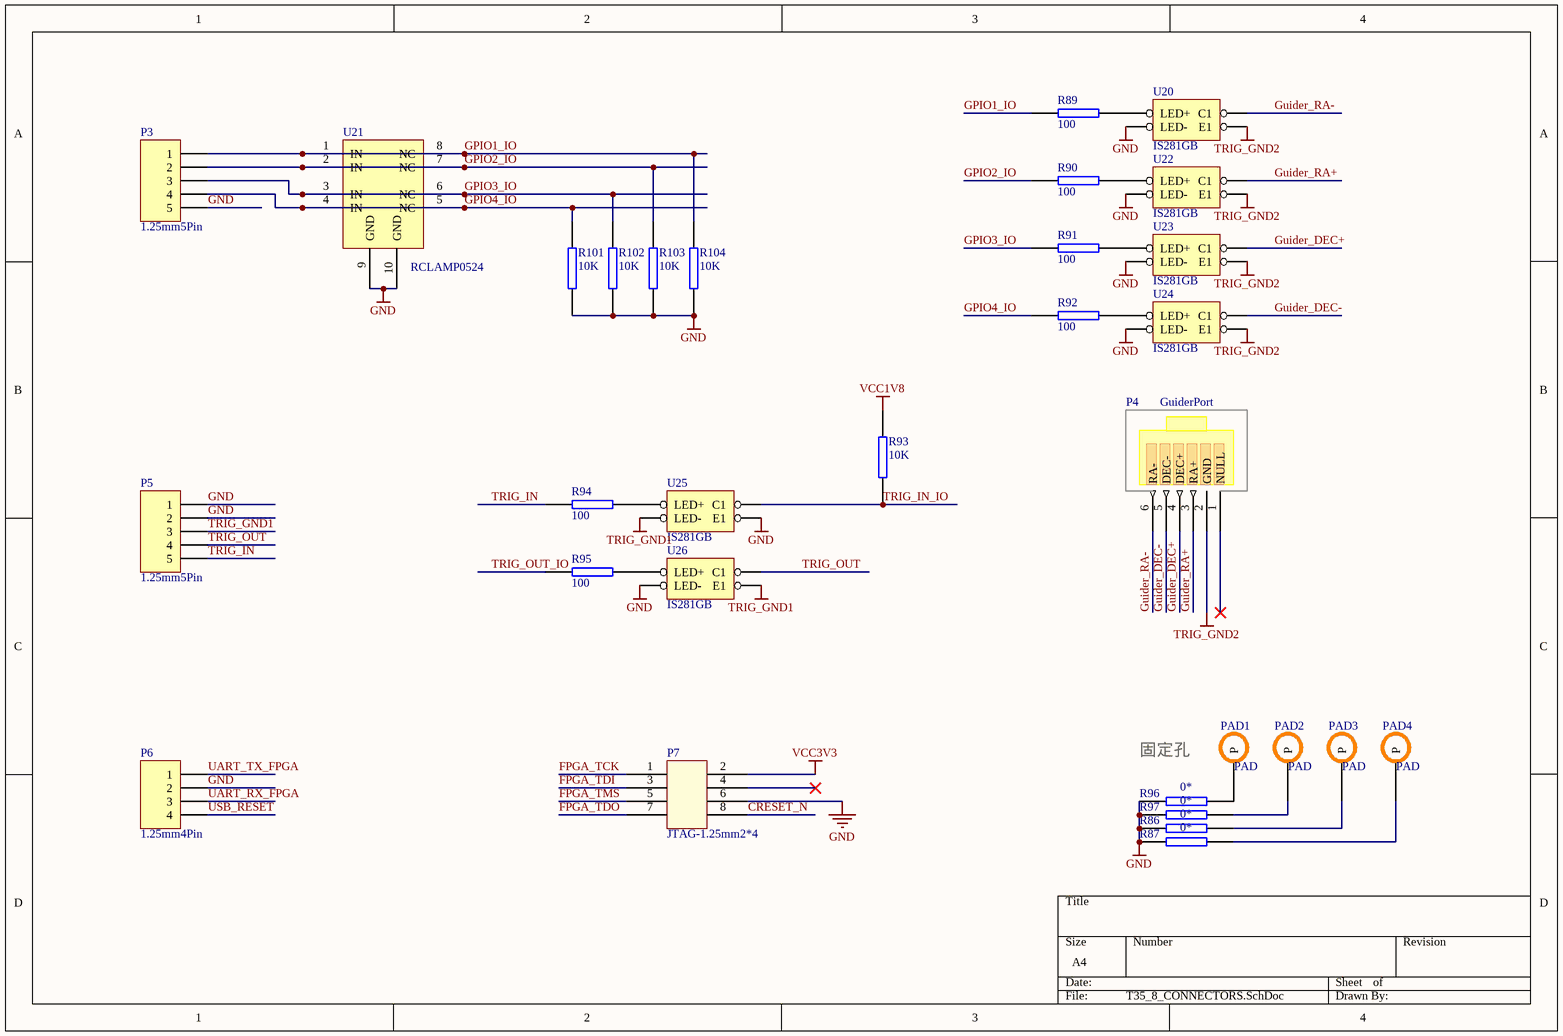
[diagram p8: T35_8_CONNECTORS.SchDoc]

### Parts
P3  1.25mm5Pin  [CC125-5]
P4  GuiderPort  [RJ11-SMD]
P5  1.25mm5Pin  [CC125-5]
P6  1.25mm4Pin  [CON_530470410_MOL]
P7  JTAG-1.25mm2*4  [MHDR2X4]
PAD1  PAD  [M2-R4-NC]
PAD2  PAD  [M2-R4-NC]
PAD3  PAD  [M1.6-R3.2-NC]
PAD4  PAD  [M1.6-R3.2-NC]
R86  0*  [0402RS]
R87  0*  [0402RS]
R89  100  [0402RS]
R90  100  [0402RS]
R91  100  [0402RS]
R92  100  [0402RS]
R93  10K  [0201RS]
R94  100  [0402RS]
R95  100  [0402RS]
R96  0*  [0402RS]
R97  0*  [0402RS]
R101  10K  [0201RS]
R102  10K  [0201RS]
R103  10K  [0201RS]
R104  10K  [0201RS]
U20  IS281GB  [TLP281-1]
U21  RCLAMP0524  [RCLAMP0524]
U22  IS281GB  [TLP281-1]
U23  IS281GB  [TLP281-1]
U24  IS281GB  [TLP281-1]
U25  IS281GB  [TLP281-1]
U26  IS281GB  [TLP281-1]

### Nets
GND: P3.5 P5.1 P5.2 P6.2 P7.6 R86.1 R87.1 R96.1 R97.1 R101.2 R102.2 R103.2 R104.2 U20.2(LED-) U21.9(GND) U21.10(GND) U22.2(LED-) U23.2(LED-) U24.2(LED-) U25.3(E1) U26.2(LED-)
TRIG_GND1: P5.3 U25.2(LED-) U26.3(E1)
TRIG_GND2: P4.2(GND) U20.3(E1) U22.3(E1) U23.3(E1) U24.3(E1)
VCC1V8: R93.1
VCC3V3: P7.2
CRESET_N: P7.8
FPGA_TCK: P7.1
FPGA_TDI: P7.3
FPGA_TDO: P7.7
FPGA_TMS: P7.5
GPIO1_IO: P3.1 R89.2 R104.1 U21.1(IN) U21.8(NC)
GPIO2_IO: P3.2 R90.2 R103.1 U21.2(IN) U21.7(NC)
GPIO3_IO: P3.3 R91.2 R102.1 U21.3(IN) U21.6(NC)
GPIO4_IO: P3.4 R92.2 R101.1 U21.4(IN) U21.5(NC)
Guider_DEC+: P4.4(DEC+) U23.4(C1)
Guider_DEC-: P4.5(DEC-) U24.4(C1)
Guider_RA+: P4.3(RA+) U22.4(C1)
Guider_RA-: P4.6(RA-) U20.4(C1)
TRIG_IN: P5.5 R94.2
TRIG_IN_IO: R93.2 U25.4(C1)
TRIG_OUT: P5.4 U26.4(C1)
TRIG_OUT_IO: R95.2
UART_RX_FPGA: P6.3
UART_TX_FPGA: P6.1
USB_RESET: P6.4
NetPAD1_1: PAD1.1(P) R96.2
NetPAD2_1: PAD2.1(P) R97.2
NetPAD3_1: PAD3.1(P) R86.2
NetPAD4_1: PAD4.1(P) R87.2
NetR89_1: R89.1 U20.1(LED+)
NetR90_1: R90.1 U22.1(LED+)
NetR91_1: R91.1 U23.1(LED+)
NetR92_1: R92.1 U24.1(LED+)
NetR94_1: R94.1 U25.1(LED+)
NetR95_1: R95.1 U26.1(LED+)

Not connected (* = marked no-connect by the designer): P4 1(NULL)*; P7 4*

### Notes on the sheet
- 固定孔

### Library data of the parts
P3 P5 = Header 5: 1.25mm间距5Pin插座; LatestRevisionDate: 17-Jul-2002; LatestRevisionNote: Re-released for DXP Platform.; Publisher: Altium Limited
P4 = GuiderPort: 导星口RJ11
P6 = Con_4: 1.25mm间距4Pin插座
P7 = 1.27mm2*4JTAGSocket: 1.25mm间距2*4 8PinJTAG烧写座; Link: https://item.szlcsc.com/3294771.html
PAD1-PAD4 = PAD: 固定孔
R86 R87 R89-R97 R101-R104 = RES2: 贴片电阻
U20 U22-U26 = TLP281_1: 光耦
  U25: ComponentLink1Description: Link; ComponentLink1URL: https://item.szlcsc.com/91059.html
U21 = RCLAMP0524: ESD保护器件

## Nets that join several sheets
GND: T35_1_IO (9 pins), T35_2_POWER_CONFIG (109 pins), T35_3_POWERSUPPLY (49 pins), T35_4_FX3 (79 pins), T35_5_MIPI (10 pins), T35_6_DDR3 (43 pins), T35_7_MEMORY (7 pins), T35_8_CONNECTORS (21 pins)
VCC1V0: T35_3_POWERSUPPLY (5 pins), T35_4_FX3 (R77.2)
VCC1V2: T35_2_POWER_CONFIG (37 pins), T35_3_POWERSUPPLY (6 pins), T35_4_FX3 (R76.2)
VCC1V5: T35_2_POWER_CONFIG (17 pins), T35_3_POWERSUPPLY (6 pins), T35_6_DDR3 (36 pins)
VCC1V8: T35_1_IO (C3.2 C4.1 U3.1 U3.4), T35_2_POWER_CONFIG (13 pins), T35_3_POWERSUPPLY (6 pins), T35_4_FX3 (7 pins), T35_5_MIPI (P2.2 P2.3), T35_8_CONNECTORS (R93.1)
VCC2V5: T35_2_POWER_CONFIG (5 pins), T35_3_POWERSUPPLY (C106.1 T15.1 U8.5)
VCC3V3: T35_1_IO (C1.2 C2.1 U2.1 U2.4), T35_2_POWER_CONFIG (44 pins), T35_3_POWERSUPPLY (6 pins), T35_4_FX3 (29 pins), T35_5_MIPI (P2.5), T35_7_MEMORY (7 pins), T35_8_CONNECTORS (P7.2)
VCC5V: T35_3_POWERSUPPLY (17 pins), T35_4_FX3 (C110.2 ECP1.1 U10.E11 U11.5), T35_5_MIPI (P2.7)
CCK: T35_2_POWER_CONFIG (U1.N13 U5.6), T35_7_MEMORY (U19.6)
CDI0: T35_2_POWER_CONFIG (U1.M13 U5.5), T35_7_MEMORY (U19.5)
CDI1: T35_2_POWER_CONFIG (U1.N14 U5.2), T35_7_MEMORY (U19.2)
CDI2: T35_2_POWER_CONFIG (R9.1 U1.K14 U5.3), T35_7_MEMORY (U19.3)
CDI3: T35_2_POWER_CONFIG (R5.1 U1.K18 U5.7), T35_7_MEMORY (U19.7)
CRESET_N: T35_2_POWER_CONFIG (R4.2 U1.N17 U4.2), T35_8_CONNECTORS (P7.8)
FLASH_CS: T35_1_IO (U1.G16), T35_7_MEMORY (R84.1 U19.1)
FPGA_TCK: T35_2_POWER_CONFIG (R15.2 U1.T16), T35_8_CONNECTORS (P7.1)
FPGA_TDI: T35_2_POWER_CONFIG (R17.2 U1.R16), T35_8_CONNECTORS (P7.3)
FPGA_TDO: T35_2_POWER_CONFIG (R16.2 U1.P17), T35_8_CONNECTORS (P7.7)
FPGA_TMS: T35_2_POWER_CONFIG (R18.2 U1.P16), T35_8_CONNECTORS (P7.5)
FX3_RESET: T35_1_IO (U1.D13), T35_4_FX3 (C117.1 R68.2 U10.C5 U14.2)
GPIO1_IO: T35_1_IO (U1.C13), T35_8_CONNECTORS (5 pins)
GPIO2_IO: T35_1_IO (U1.E15), T35_8_CONNECTORS (5 pins)
GPIO3_IO: T35_1_IO (U1.E14), T35_8_CONNECTORS (5 pins)
GPIO4_IO: T35_1_IO (U1.D14), T35_8_CONNECTORS (5 pins)
I2CSCL: T35_4_FX3 (R72.2 U15.3 U16.6), T35_5_MIPI (P2.22 T24.1 U1.A9)
I2CSCL_33: T35_3_POWERSUPPLY (R29.2), T35_4_FX3 (R59.2 U10.D9 U15.6), T35_7_MEMORY (U18.6)
I2CSDA: T35_4_FX3 (R71.2 U15.4 U16.5), T35_5_MIPI (P2.21 T26.1 U1.A10)
I2CSDA_33: T35_3_POWERSUPPLY (R27.2), T35_4_FX3 (R60.2 U10.D10 U15.5), T35_7_MEMORY (U18.5)
TRIG_IN_IO: T35_1_IO (U1.D11), T35_8_CONNECTORS (R93.2 U25.4)
TRIG_OUT_IO: T35_1_IO (U1.C11), T35_8_CONNECTORS (R95.2)
UART_RX_FPGA: T35_1_IO (U1.D16), T35_8_CONNECTORS (P6.3)
UART_RX_FX3: T35_1_IO (U1.E13), T35_4_FX3 (R69.2 T19.1 U10.D5)
UART_TX_FPGA: T35_1_IO (U1.C16), T35_8_CONNECTORS (P6.1)
UART_TX_FX3: T35_1_IO (U1.F13), T35_4_FX3 (T18.1 U10.C2)
USB_RESET: T35_1_IO (U1.D15), T35_8_CONNECTORS (P6.4)